# EAGLE design BrushlessLampRoutes (EAGLE 9.7.0)
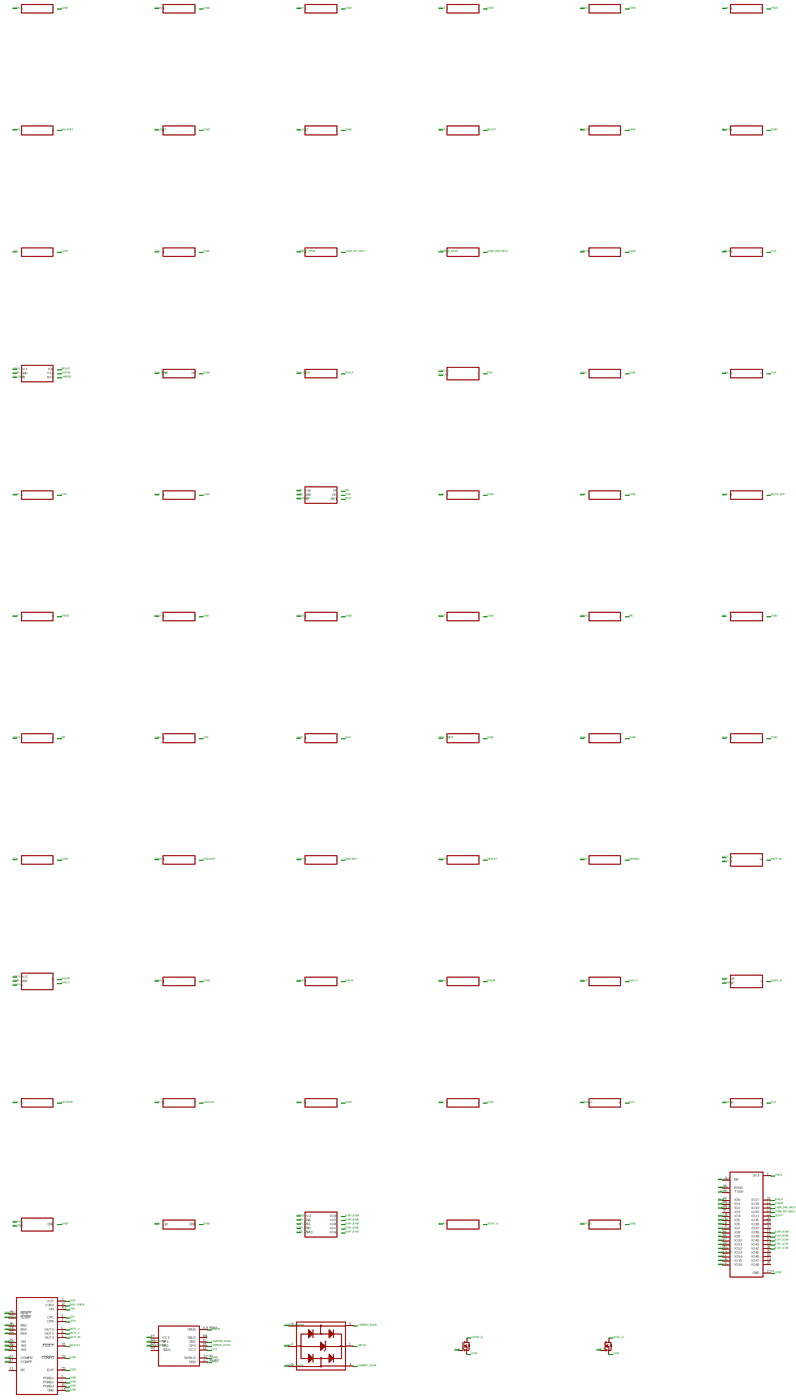
[diagram p0: schematic, sheet 1, overview]
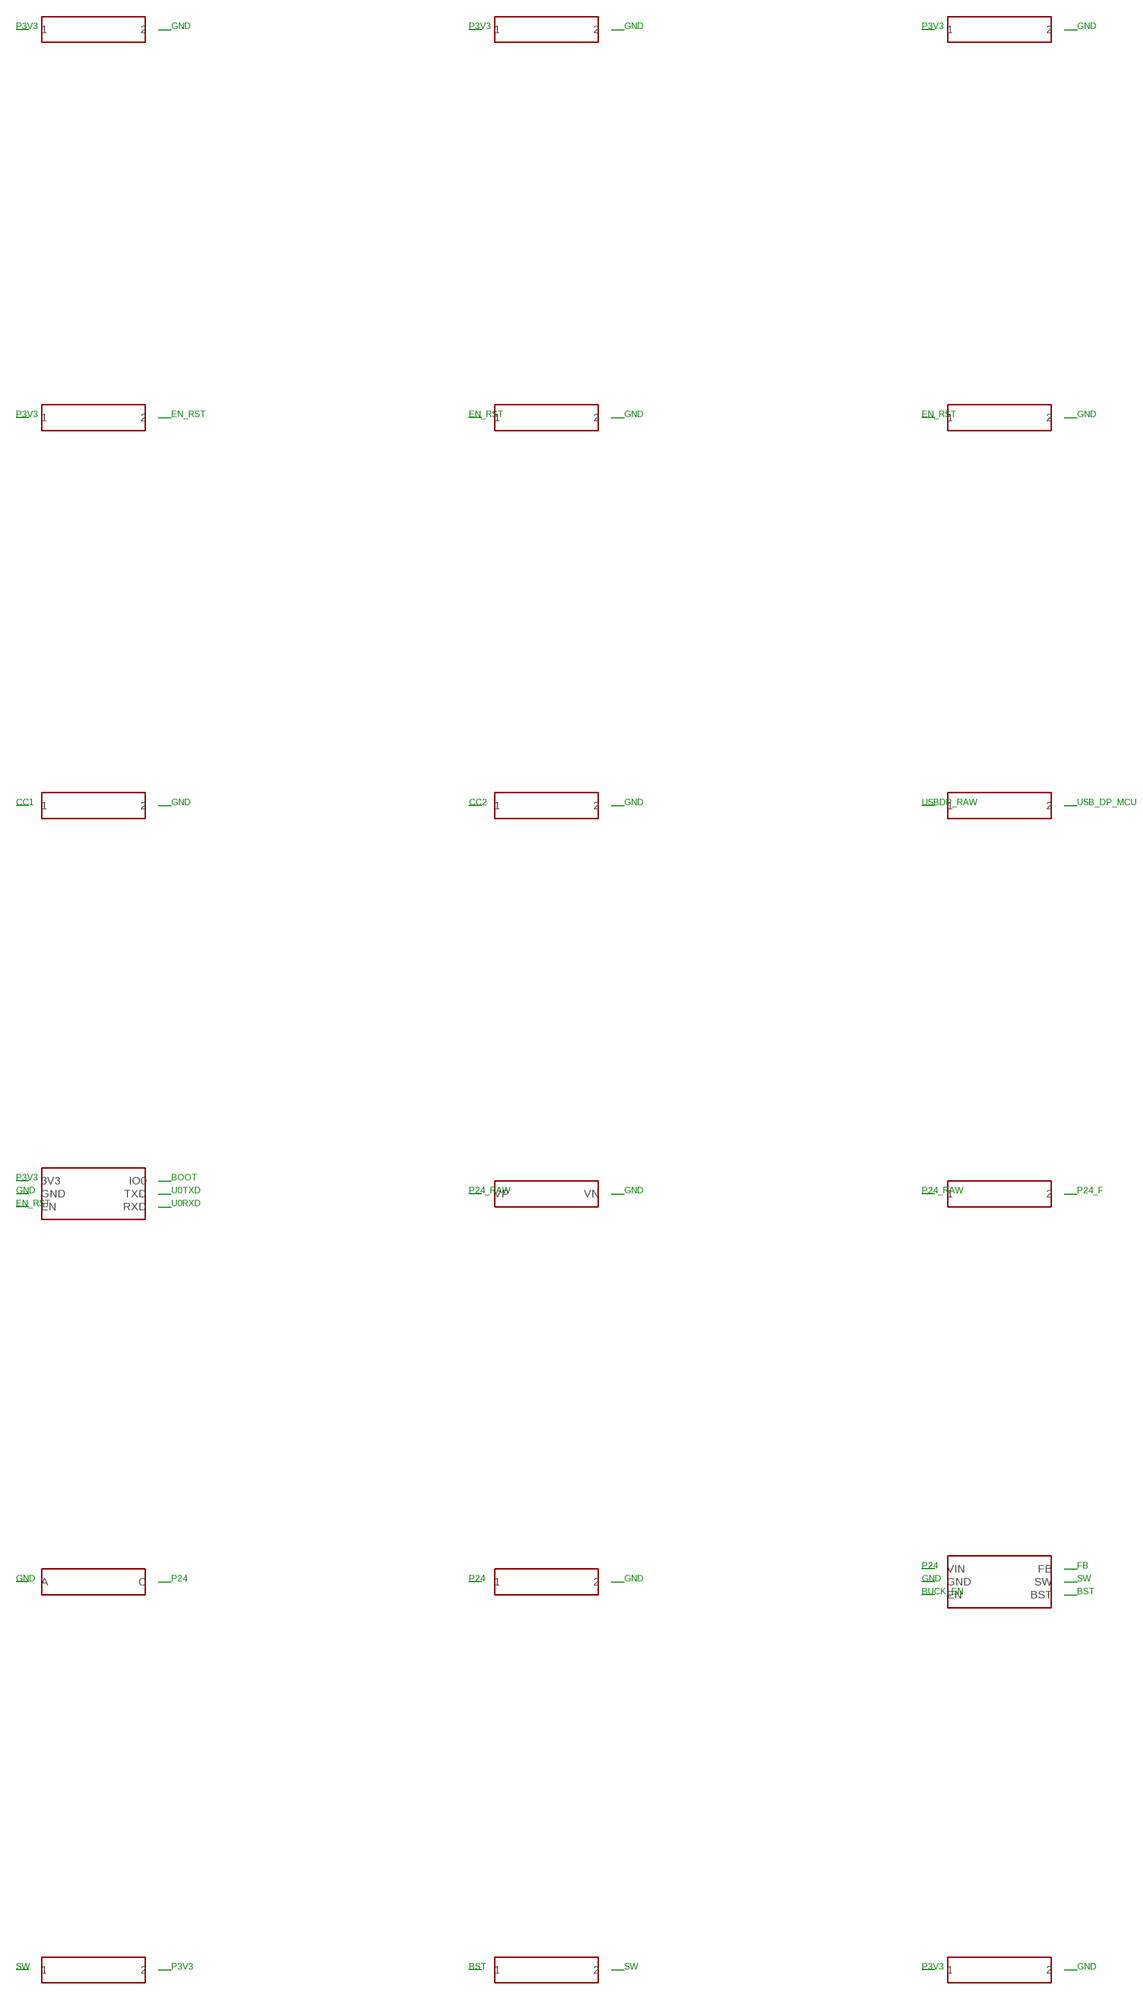
[diagram p1: schematic, sheet 1, part 1 of 4]
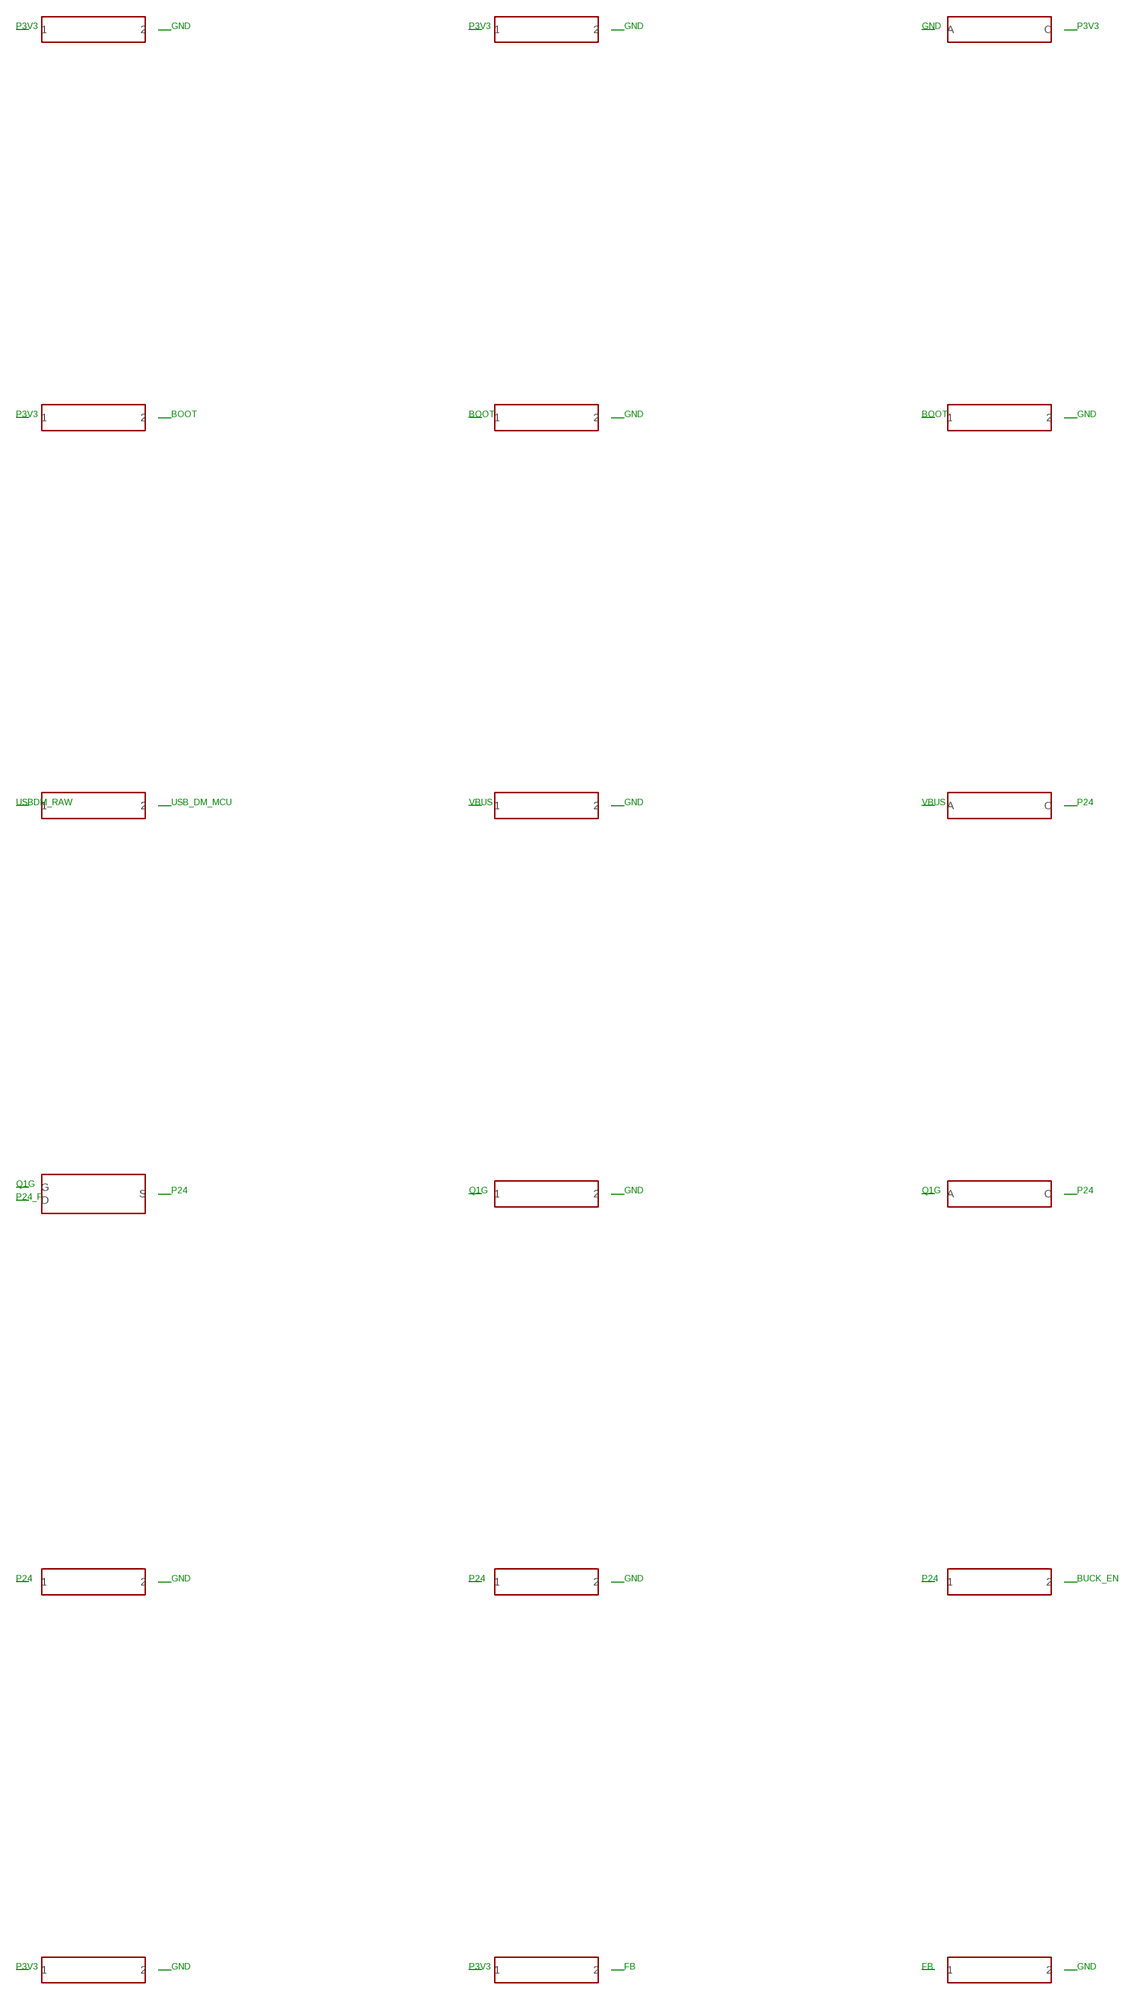
[diagram p2: schematic, sheet 1, part 2 of 4]
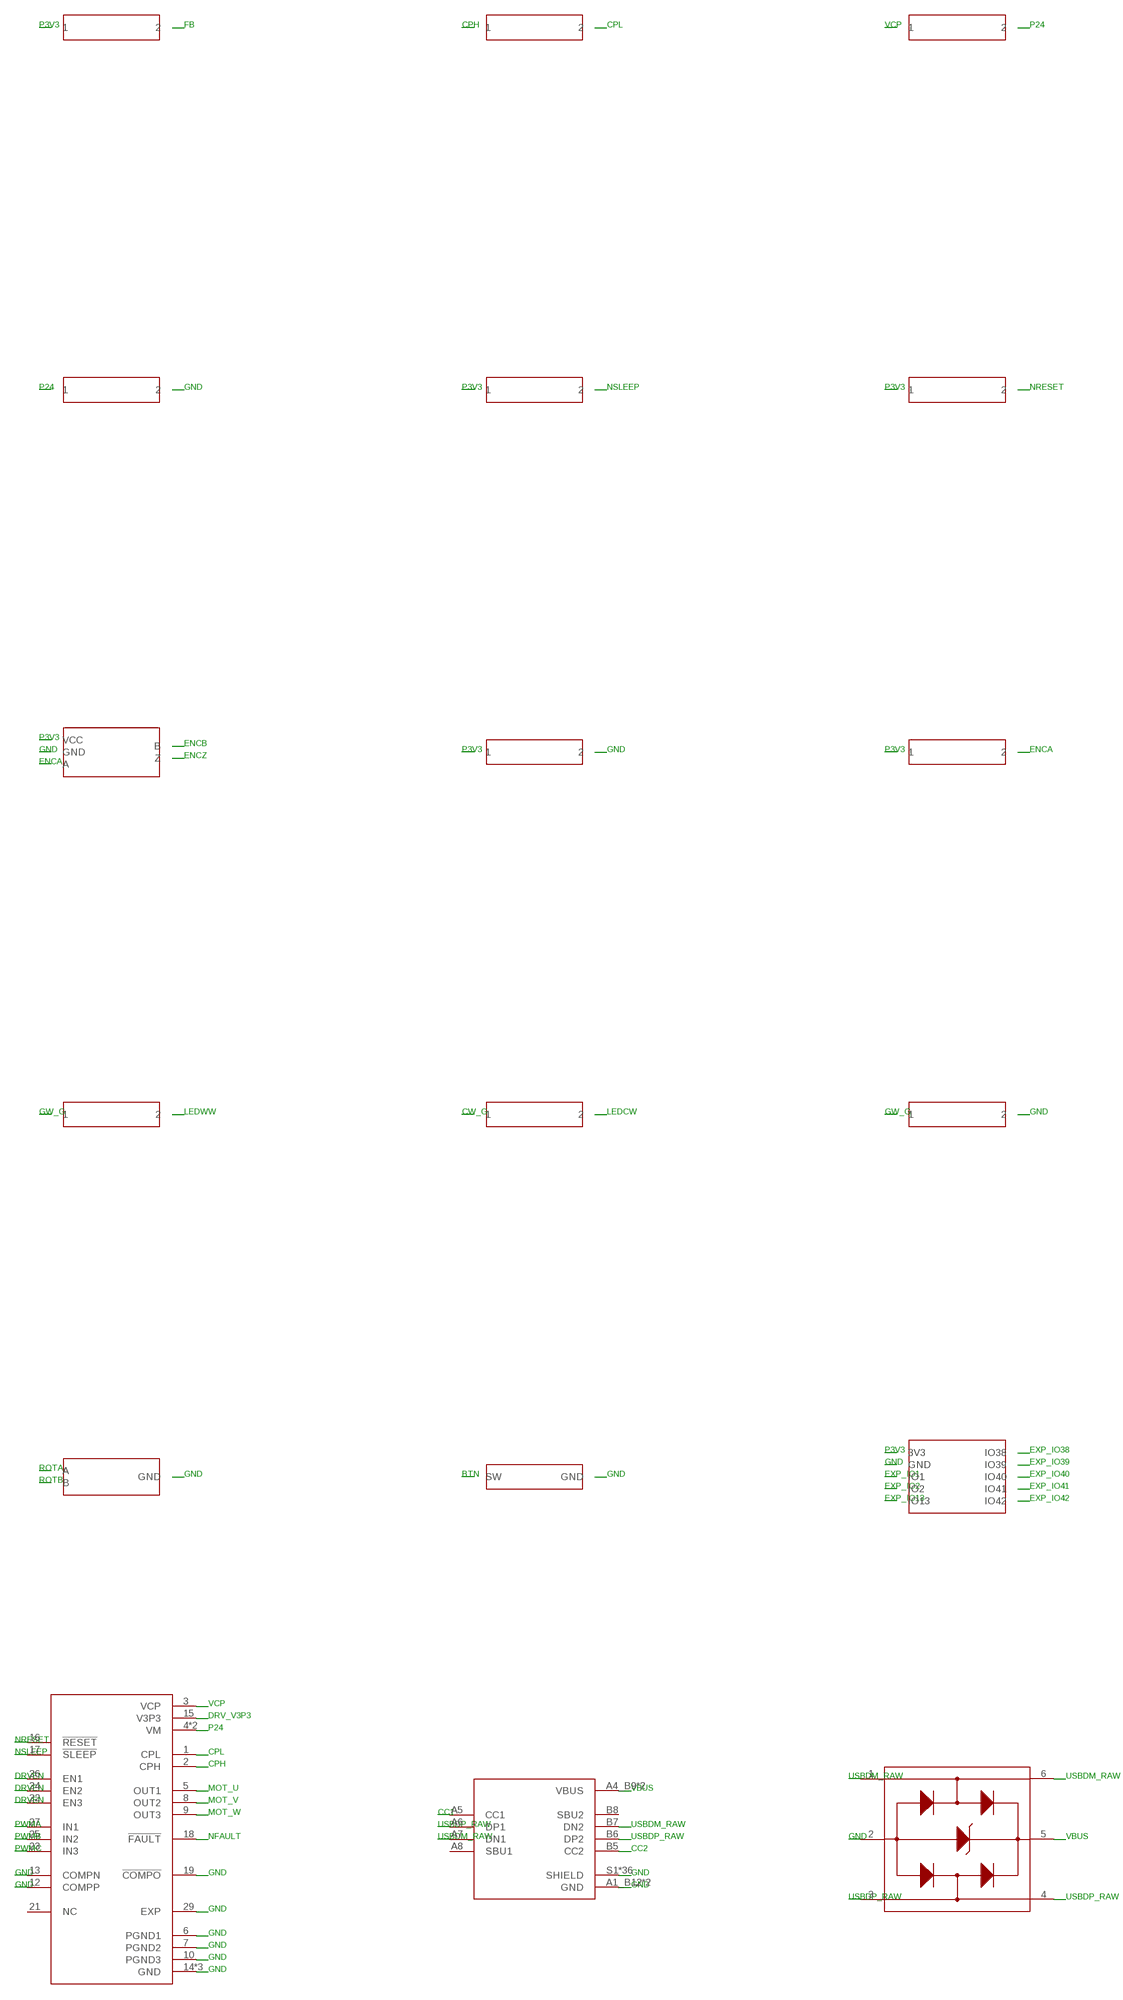
[diagram p3: schematic, sheet 1, part 3 of 4]
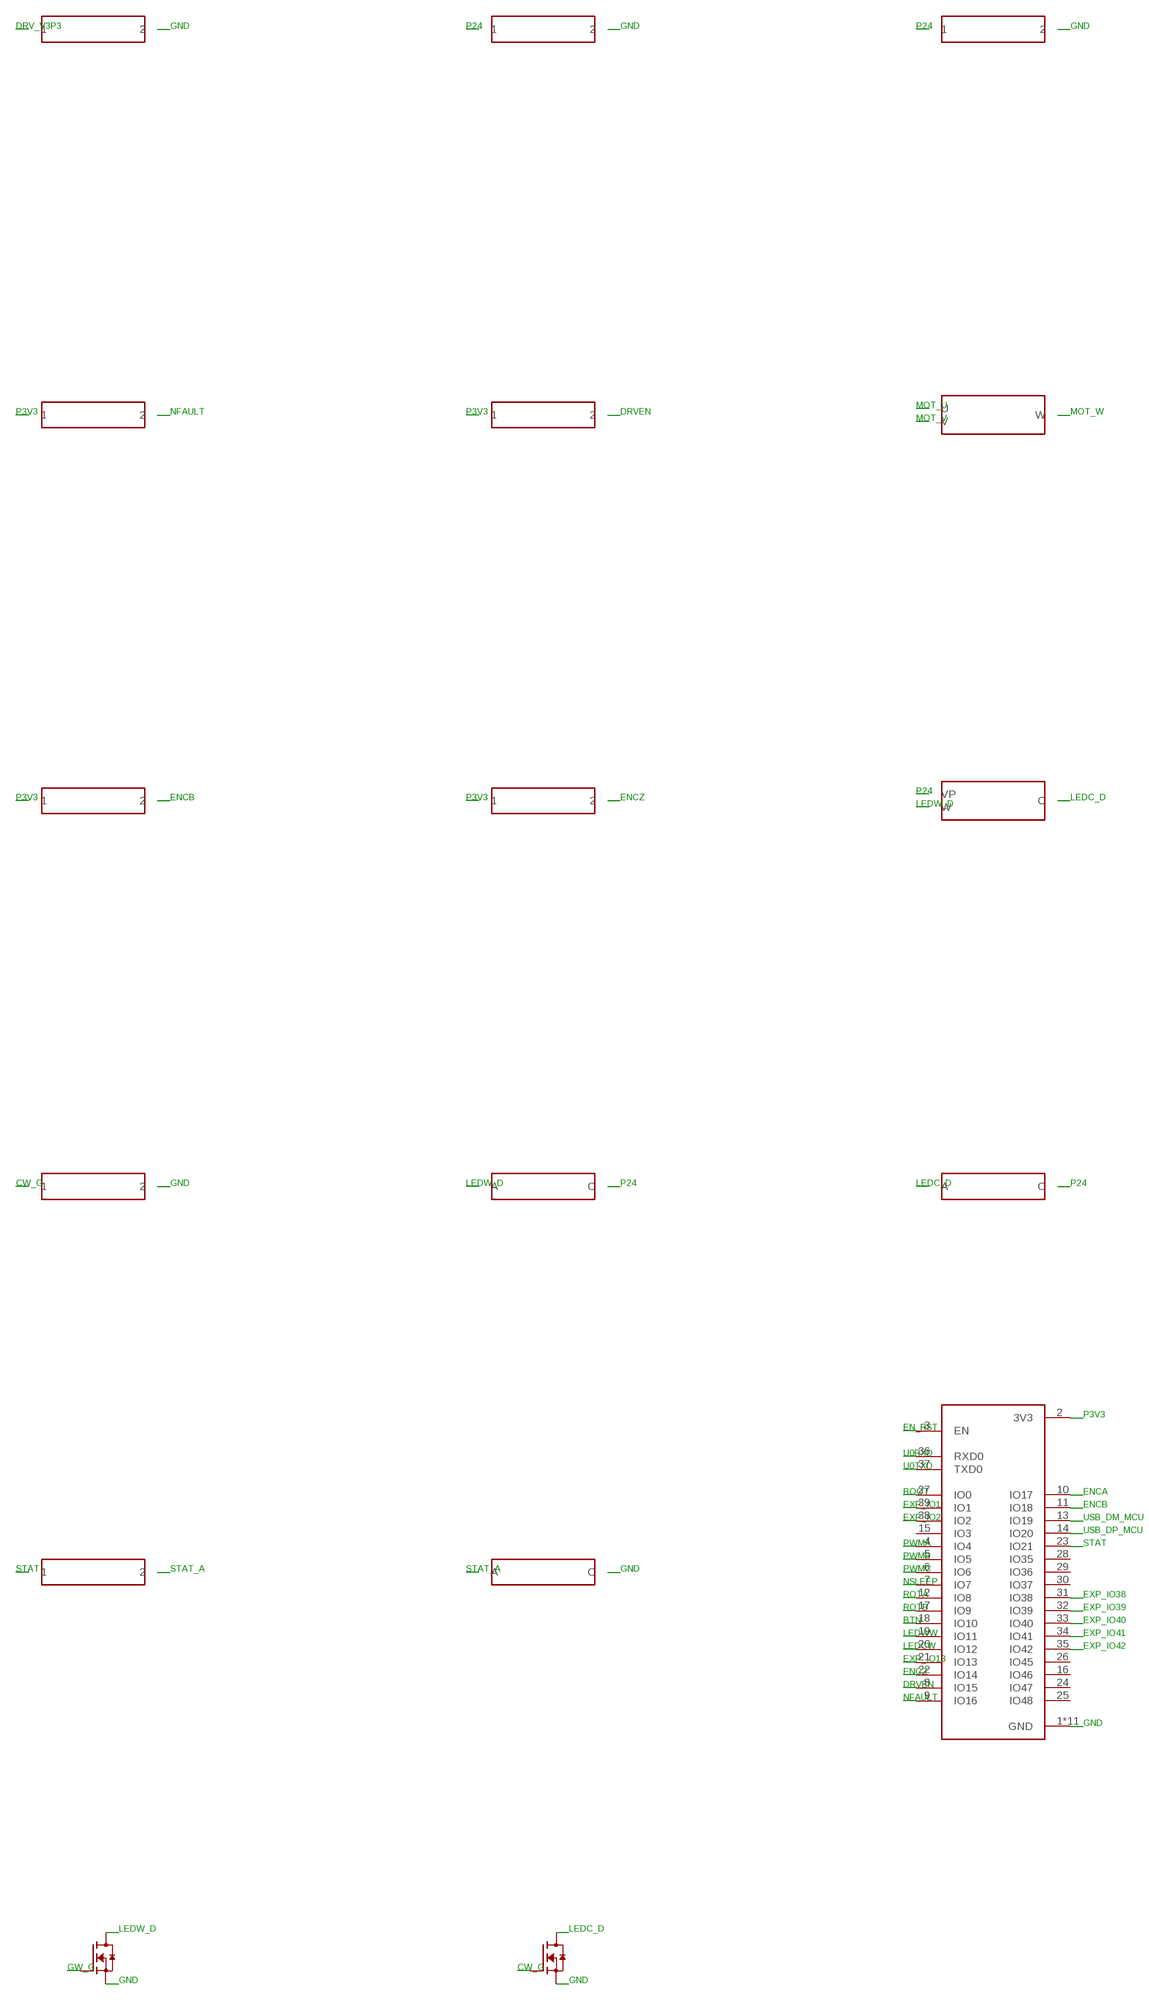
[diagram p4: schematic, sheet 1, part 4 of 4]

## Parts
C_BOOT  100p  CAP_0402  [0402]
C_BOOT_B  100n  CAP_0402  [0402]
C_CP  10n  CAP_0603  [0603]
C_EN  1u  CAP_0603  [0603]
C_FF  22p  CAP_0402  [0402]
C_IN1  10u-50V  CAP_1210  [1210]
C_IN2  4.7u-50V  CAP_1206  [1206]
C_IN_BULK  100u-50V  CAP_V  [CAP_V]
C_MCU1  10u  CAP_0805  [0805]
C_MCU2  1u  CAP_0603  [0603]
C_MCU3  100n  CAP_0402  [0402]
C_MCU4  100n  CAP_0402  [0402]
C_MCU_BULK  470u  CAP_D  [CAP_D]
C_OUT1  22u  CAP_0805  [0805]
C_OUT2  22u  CAP_0805  [0805]
C_SENS  100n  CAP_0402  [0402]
C_V3P3  470n  CAP_0603  [0603]
C_VBUS  4.7u  CAP_0603  [0603]
C_VCP  100n  CAP_0603  [0603]
C_VM1  100n-50V  CAP_0603  [0603]
C_VM2  100n-50V  CAP_0603  [0603]
C_VM_BULK  100u-50V  CAP_V  [CAP_V]
D_CLC  clamp-DNP  DIODE_SOD323  [SOD323]
D_CLW  clamp-DNP  DIODE_SOD323  [SOD323]
D_MCU  ESD  DIODE_SOD323  [SOD323]
D_OR_USB  SS14  DIODE_SMA  [SMA]
D_Q1  10V-Zener  DIODE_SOD123  [SOD123]
D_USB  USBLC6-2SC6  [SOT95P280X145-6N]
F1  2A  FUSE_NANO2  [FUSENANO2]
J_BTN  BUTTON  CONN_BTN_DS  [XH2]
J_EXP  GPIO-EXP  CONN_EXP_DS  [HDR10]
J_KNOB  KNOB  CONN_KNOB_DS  [XH3]
J_LED  CCT-STRIP  CONN_LED_DS  [XH3]
J_MOTOR  MOTOR  CONN_MOTOR_DS  [SCREW3]
J_PROG  UART-FALLBACK  CONN_PROG_DS  [HDR6]
J_PWR  24V-IN  CONN_PWR_DS  [SCREW2]
J_SENSOR  MT6701  CONN_SENSOR_DS  [SCREW5]
J_USB  TYPE-C-31-M-12  [HRO_TYPE-C-31-M-12]
L1  4.7uH  IND_SMD  [IND43]
LED_STATUS  STATUS  LED_0603  [LED0603]
Q1  PMOS-RevProt  FET_SOT23  [SOT23]
Q_CW  AO3400A  [SOT95P280X125-3N]
Q_WW  AO3400A  [SOT95P280X125-3N]
R_AZ_A  10k-DNP  RES_0603  [0603]
R_AZ_B  10k-DNP  RES_0603  [0603]
R_AZ_C  10k-DNP  RES_0603  [0603]
R_BOOT  10k  RES_0603  [0603]
R_CC1  5.1k  RES_0603  [0603]
R_CC2  5.1k  RES_0603  [0603]
R_DM  22R  RES_0603  [0603]
R_DP  22R  RES_0603  [0603]
R_EN  10k  RES_0603  [0603]
R_EN_DRV  10k  RES_0603  [0603]
R_ENB  100k  RES_0603  [0603]
R_FBB  10k  RES_0603  [0603]
R_FBT  45.3k  RES_0603  [0603]
R_GC  33R  RES_0603  [0603]
R_GW  33R  RES_0603  [0603]
R_NFAULT  10k  RES_0603  [0603]
R_NRESET  10k  RES_0603  [0603]
R_NSLEEP  10k  RES_0603  [0603]
R_PDC  100k  RES_0603  [0603]
R_PDW  100k  RES_0603  [0603]
R_Q1  100k  RES_0603  [0603]
R_STATUS  1k  RES_0603  [0603]
SW_BOOT  BOOT  SW_TACT  [TACT]
SW_RST  RESET  SW_TACT  [TACT]
TVS1  SMBJ28A  DIODE_SMB  [SMB]
U_BUCK  LMR51430  BUCK_DS  [SOT236]
U_DRV  DRV8313PWPR  [SOP65P640X120-29N]
U_MCU  ESP32-S3-WROOM-1-N8R8  [XCVR_ESP32S3WROOM1N8R8]

## Nets
BOOT: C_BOOT.1 J_PROG.4(IO0) R_BOOT.2 SW_BOOT.1 SW_BOOT.2 U_MCU.27(IO0)
BST: C_BOOT_B.1 U_BUCK.6(BST)
BTN: J_BTN.1(SW) U_MCU.18(IO10)
BUCK_EN: R_ENB.2 U_BUCK.5(EN)
CC1: J_USB.A5(CC1) R_CC1.1
CC2: J_USB.B5(CC2) R_CC2.1
CPH: C_CP.1 U_DRV.2(CPH)
CPL: C_CP.2 U_DRV.1(CPL)
CW_G: Q_CW.1(G) R_GC.1 R_PDC.1
DRV_V3P3: C_V3P3.1 U_DRV.15(V3P3)
DRVEN: R_EN_DRV.2 U_DRV.22(EN3) U_DRV.24(EN2) U_DRV.26(EN1) U_MCU.8(IO15)
EN_RST: C_EN.1 J_PROG.3(EN) R_EN.2 SW_RST.1 SW_RST.2 U_MCU.3(EN)
ENCA: J_SENSOR.3(A) R_AZ_A.2 U_MCU.10(IO17)
ENCB: J_SENSOR.4(B) R_AZ_B.2 U_MCU.11(IO18)
ENCZ: J_SENSOR.5(Z) R_AZ_C.2 U_MCU.22(IO14)
EXP_IO1: J_EXP.3(IO1) U_MCU.39(IO1)
EXP_IO2: J_EXP.4(IO2) U_MCU.38(IO2)
EXP_IO13: J_EXP.5(IO13) U_MCU.21(IO13)
EXP_IO38: J_EXP.6(IO38) U_MCU.31(IO38)
EXP_IO39: J_EXP.7(IO39) U_MCU.32(IO39)
EXP_IO40: J_EXP.8(IO40) U_MCU.33(IO40)
EXP_IO41: J_EXP.9(IO41) U_MCU.34(IO41)
EXP_IO42: J_EXP.10(IO42) U_MCU.35(IO42)
FB: C_FF.2 R_FBB.1 R_FBT.2 U_BUCK.4(FB)
GND: C_BOOT.2 C_EN.2 C_IN1.2 C_IN2.2 C_IN_BULK.2 C_MCU1.2 C_MCU2.2 C_MCU3.2 C_MCU4.2 C_MCU_BULK.2 C_OUT1.2 C_OUT2.2 C_SENS.2 C_V3P3.2 C_VBUS.2 C_VM1.2 C_VM2.2 C_VM_BULK.2 D_MCU.A D_USB.2(GND) J_BTN.2(GND) J_EXP.2(GND) J_KNOB.3(GND) J_PROG.2(GND) J_PWR.2(VN) J_SENSOR.2(GND) J_USB.A1_B12(GND) J_USB.B1_A12(GND) J_USB.S1(SHIELD) J_USB.S1B(SHIELD) J_USB.S1C(SHIELD) J_USB.S1D(SHIELD) J_USB.S1E(SHIELD) J_USB.S1F(SHIELD) J_USB.S1G(SHIELD) J_USB.S1H(SHIELD) J_USB.S1I(SHIELD) J_USB.S2(SHIELD) J_USB.S2B(SHIELD) J_USB.S2C(SHIELD) J_USB.S2D(SHIELD) J_USB.S2E(SHIELD) J_USB.S2F(SHIELD) J_USB.S2G(SHIELD) J_USB.S2H(SHIELD) J_USB.S2I(SHIELD) J_USB.S3(SHIELD) J_USB.S3B(SHIELD) J_USB.S3C(SHIELD) J_USB.S3D(SHIELD) J_USB.S3E(SHIELD) J_USB.S3F(SHIELD) J_USB.S3G(SHIELD) J_USB.S3H(SHIELD) J_USB.S3I(SHIELD) J_USB.S4(SHIELD) J_USB.S4B(SHIELD) J_USB.S4C(SHIELD) J_USB.S4D(SHIELD) J_USB.S4E(SHIELD) J_USB.S4F(SHIELD) J_USB.S4G(SHIELD) J_USB.S4H(SHIELD) J_USB.S4I(SHIELD) LED_STATUS.C Q_CW.2(S) Q_WW.2(S) R_CC1.2 R_CC2.2 R_FBB.2 R_PDC.2 R_PDW.2 R_Q1.2 SW_BOOT.3 SW_BOOT.4 SW_RST.3 SW_RST.4 TVS1.A U_BUCK.1(GND) U_DRV.6(PGND1) U_DRV.7(PGND2) U_DRV.10(PGND3) U_DRV.12(COMPP) U_DRV.13(COMPN) U_DRV.14(GND) U_DRV.19(!COMPO) U_DRV.20(GND) U_DRV.28(GND) U_DRV.29(EXP) U_MCU.1(GND) U_MCU.40(GND) U_MCU.41_1(GND) U_MCU.41_2(GND) U_MCU.41_3(GND) U_MCU.41_4(GND) U_MCU.41_5(GND) U_MCU.41_6(GND) U_MCU.41_7(GND) U_MCU.41_8(GND) U_MCU.41_9(GND)
GW_G: Q_WW.1(G) R_GW.1 R_PDW.1
LEDC_D: D_CLC.A J_LED.3(C) Q_CW.3(D)
LEDCW: R_GC.2 U_MCU.20(IO12)
LEDW_D: D_CLW.A J_LED.2(W) Q_WW.3(D)
LEDWW: R_GW.2 U_MCU.19(IO11)
MOT_U: J_MOTOR.1(U) U_DRV.5(OUT1)
MOT_V: J_MOTOR.2(V) U_DRV.8(OUT2)
MOT_W: J_MOTOR.3(W) U_DRV.9(OUT3)
NFAULT: R_NFAULT.2 U_DRV.18(!FAULT) U_MCU.9(IO16)
NRESET: R_NRESET.2 U_DRV.16(!RESET)
NSLEEP: R_NSLEEP.2 U_DRV.17(!SLEEP) U_MCU.7(IO7)
P3V3 [pwr3v3]: C_FF.1 C_MCU1.1 C_MCU2.1 C_MCU3.1 C_MCU4.1 C_MCU_BULK.1 C_OUT1.1 C_OUT2.1 C_SENS.1 D_MCU.C J_EXP.1(3V3) J_PROG.1(3V3) J_SENSOR.1(VCC) L1.2 R_AZ_A.1 R_AZ_B.1 R_AZ_C.1 R_BOOT.1 R_EN.1 R_EN_DRV.1 R_FBT.1 R_NFAULT.1 R_NRESET.1 R_NSLEEP.1 U_MCU.2(3V3)
P24 [pwr24]: C_IN1.1 C_IN2.1 C_IN_BULK.1 C_VCP.2 C_VM1.1 C_VM2.1 C_VM_BULK.1 D_CLC.C D_CLW.C D_OR_USB.C D_Q1.C J_LED.1(VP) Q1.2(S) R_ENB.1 TVS1.C U_BUCK.3(VIN) U_DRV.4(VM) U_DRV.11(VM)
P24_F [pwr24]: F1.2 Q1.3(D)
P24_RAW [pwr24]: F1.1 J_PWR.1(VP)
PWMA: U_DRV.27(IN1) U_MCU.4(IO4)
PWMB: U_DRV.25(IN2) U_MCU.5(IO5)
PWMC: U_DRV.23(IN3) U_MCU.6(IO6)
Q1G: D_Q1.A Q1.1(G) R_Q1.1
ROTA: J_KNOB.1(A) U_MCU.12(IO8)
ROTB: J_KNOB.2(B) U_MCU.17(IO9)
STAT: R_STATUS.1 U_MCU.23(IO21)
STAT_A: LED_STATUS.A R_STATUS.2
SW: C_BOOT_B.2 L1.1 U_BUCK.2(SW)
U0RXD: J_PROG.6(RXD) U_MCU.36(RXD0)
U0TXD: J_PROG.5(TXD) U_MCU.37(TXD0)
USB_DM_MCU: R_DM.2 U_MCU.13(IO19)
USB_DP_MCU: R_DP.2 U_MCU.14(IO20)
USBDM_RAW: D_USB.1(I/O1_IN) D_USB.6(I/O1_OUT) J_USB.A7(DN1) J_USB.B7(DN2) R_DM.1
USBDP_RAW: D_USB.3(I/O2_IN) D_USB.4(I/O2_OUT) J_USB.A6(DP1) J_USB.B6(DP2) R_DP.1
VBUS [pwr3v3]: C_VBUS.1 D_OR_USB.A D_USB.5(VBUS) J_USB.A4_B9(VBUS) J_USB.B4_A9(VBUS)
VCP: C_VCP.1 U_DRV.3(VCP)
Unconnected: J_USB.A8(SBU1) J_USB.B8(SBU2) U_DRV.21(NC) U_MCU.15(IO3) U_MCU.16(IO46) U_MCU.24(IO47) U_MCU.25(IO48) U_MCU.26(IO45) U_MCU.28(IO35) U_MCU.29(IO36) U_MCU.30(IO37)

## Library data of the parts
C_BOOT C_BOOT_B C_FF C_MCU3 C_MCU4 C_SENS = BLLIB:CAP_0402
C_CP C_EN C_MCU2 C_V3P3 C_VBUS C_VCP C_VM1 C_VM2 = BLLIB:CAP_0603
C_IN1 = BLLIB:CAP_1210
C_IN2 = BLLIB:CAP_1206
C_IN_BULK C_VM_BULK = BLLIB:CAP_V
C_MCU1 C_OUT1 C_OUT2 = BLLIB:CAP_0805
C_MCU_BULK = BLLIB:CAP_D
D_CLC D_CLW D_MCU = BLLIB:DIODE_SOD323
D_OR_USB = BLLIB:DIODE_SMA
D_Q1 = BLLIB:DIODE_SOD123
D_USB = USBLC6-2SC6:USBLC6-2SC6: Check availability <https://pricing.snapeda.com/parts/USBLC6-2SC6/STMicroelectronics/view-part?ref=eda>; AVAILABILITY: In Stock; CHECK_PRICES: https://www.snapeda.com/parts/USBLC6-2SC6/STMicroelectronics/view-part/?ref=eda; DESCRIPTION: 17V Clamp 5A (8/20µs) Ipp Tvs Diode Surface Mount SOT-23-6; MF: STMicroelectronics; MP: USBLC6-2SC6; PACKAGE: SOT-23-6 STMicroelectronics; PRICE: None; PURCHASE-URL: https://www.snapeda.com/api/url_track_click_mouser/?unipart_id=231887&manufacturer=STMicroelectronics&part_name=USBLC6-2SC6&search_term= usblc6-2sc6; SNAPEDA_LINK: https://www.snapeda.com/parts/USBLC6-2SC6/STMicroelectronics/view-part/?ref=snap
F1 = BLLIB:FUSE_NANO2
J_BTN = JST-XH-BL:CONN_BTN_DS
J_EXP = BLLIB:CONN_EXP_DS
J_KNOB = JST-XH-BL:CONN_KNOB_DS
J_LED = JST-XH-BL:CONN_LED_DS
J_MOTOR = BLLIB:CONN_MOTOR_DS
J_PROG = BLLIB:CONN_PROG_DS
J_PWR = BLLIB:CONN_PWR_DS
J_SENSOR = KF350-SENSOR:CONN_SENSOR_DS
J_USB = TYPE-C-31-M-12:TYPE-C-31-M-12: Check availability <https://pricing.snapeda.com/parts/TYPE-C-31-M-12/HRO%20Electronics%20Co.%2C%20Ltd./view-part?ref=eda>; AVAILABILITY: Not in stock; CHECK_PRICES: https://www.snapeda.com/parts/TYPE-C-31-M-12/HRO+Electronics+Co.%252C+Ltd./view-part/?ref=eda; DESCRIPTION: USB Connectors 24 Receptacle 1 8.94*7.3mm RoHS; MF: HRO Electronics Co., Ltd.; MP: TYPE-C-31-M-12; PACKAGE: Package; PRICE: None; SNAPEDA_LINK: https://www.snapeda.com/parts/TYPE-C-31-M-12/HRO+Electronics+Co.%252C+Ltd./view-part/?ref=snap
L1 = BLLIB:IND_SMD
LED_STATUS = BLLIB:LED_0603
Q1 = BLLIB:FET_SOT23
Q_CW Q_WW = AO3400A:AO3400A: Check availability <https://pricing.snapeda.com/parts/AO3400A/UMW/view-part?ref=eda>; AVAILABILITY: In Stock; CHECK_PRICES: https://www.snapeda.com/parts/AO3400A/UMW/view-part/?ref=eda; DESCRIPTION: N-Channel 30 V 5.8A (Ta) 1.4W (Ta) Surface Mount SOT-23; MF: UMW; MP: AO3400A; PACKAGE: None; PRICE: None; SNAPEDA_LINK: https://www.snapeda.com/parts/AO3400A/UMW/view-part/?ref=snap
R_AZ_A R_AZ_B R_AZ_C R_BOOT R_CC1 R_CC2 R_DM R_DP R_EN R_EN_DRV R_ENB R_FBB R_FBT R_GC R_GW R_NFAULT R_NRESET R_NSLEEP R_PDC R_PDW R_Q1 R_STATUS = BLLIB:RES_0603
SW_BOOT SW_RST = TS-1187A:SW_TACT
TVS1 = BLLIB:DIODE_SMB
U_BUCK = BLLIB:BUCK_DS
U_DRV = DRV8313PWPR:DRV8313PWPR: Check availability <https://pricing.snapeda.com/parts/DRV8313PWPR/Texas%20Instruments/view-part?ref=eda>; AVAILABILITY: In Stock; CHECK_PRICES: https://www.snapeda.com/parts/DRV8313PWPR/Texas+Instruments/view-part/?ref=eda; DESCRIPTION: 65-V max 3-A peak 3-phase motor driver with integrated FETs; MF: Texas Instruments; MP: DRV8313PWPR; PACKAGE: HTSSOP-28 Texas Instruments; PRICE: None; SNAPEDA_LINK: https://www.snapeda.com/parts/DRV8313PWPR/Texas+Instruments/view-part/?ref=snap
U_MCU = ESP32-S3-WROOM-1-N8R8:ESP32-S3-WROOM-1-N8R8: Check availability <https://pricing.snapeda.com/parts/ESP32-S3-WROOM-1-N8R8/Espressif%20Systems/view-part?ref=eda>; AVAILABILITY: In Stock; CHECK_PRICES: https://www.snapeda.com/parts/ESP32-S3-WROOM-1-N8R8/Espressif+Systems/view-part/?ref=eda; DESCRIPTION: Bluetooth, WiFi 802.11b/g/n, Bluetooth v5.0 Transceiver Module 2.4GHz PCB Trace Surface Mount; MF: Espressif Systems; MP: ESP32-S3-WROOM-1-N8R8; PACKAGE: NON STANDARD Espressif Systems; PRICE: None; PURCHASE-URL: https://www.snapeda.com/api/url_track_click_mouser/?unipart_id=8936581&manufacturer=Espressif Systems&part_name=ESP32-S3-WROOM-1-N8R8&search_term= esp32-s3-wroom-1-n8r8; SNAPEDA_LINK: https://www.snapeda.com/parts/ESP32-S3-WROOM-1-N8R8/Espressif+Systems/view-part/?ref=snap

## Net classes
1 pwr24: width 0.4 mm
2 pwr3v3: width 0.25 mm

## Board
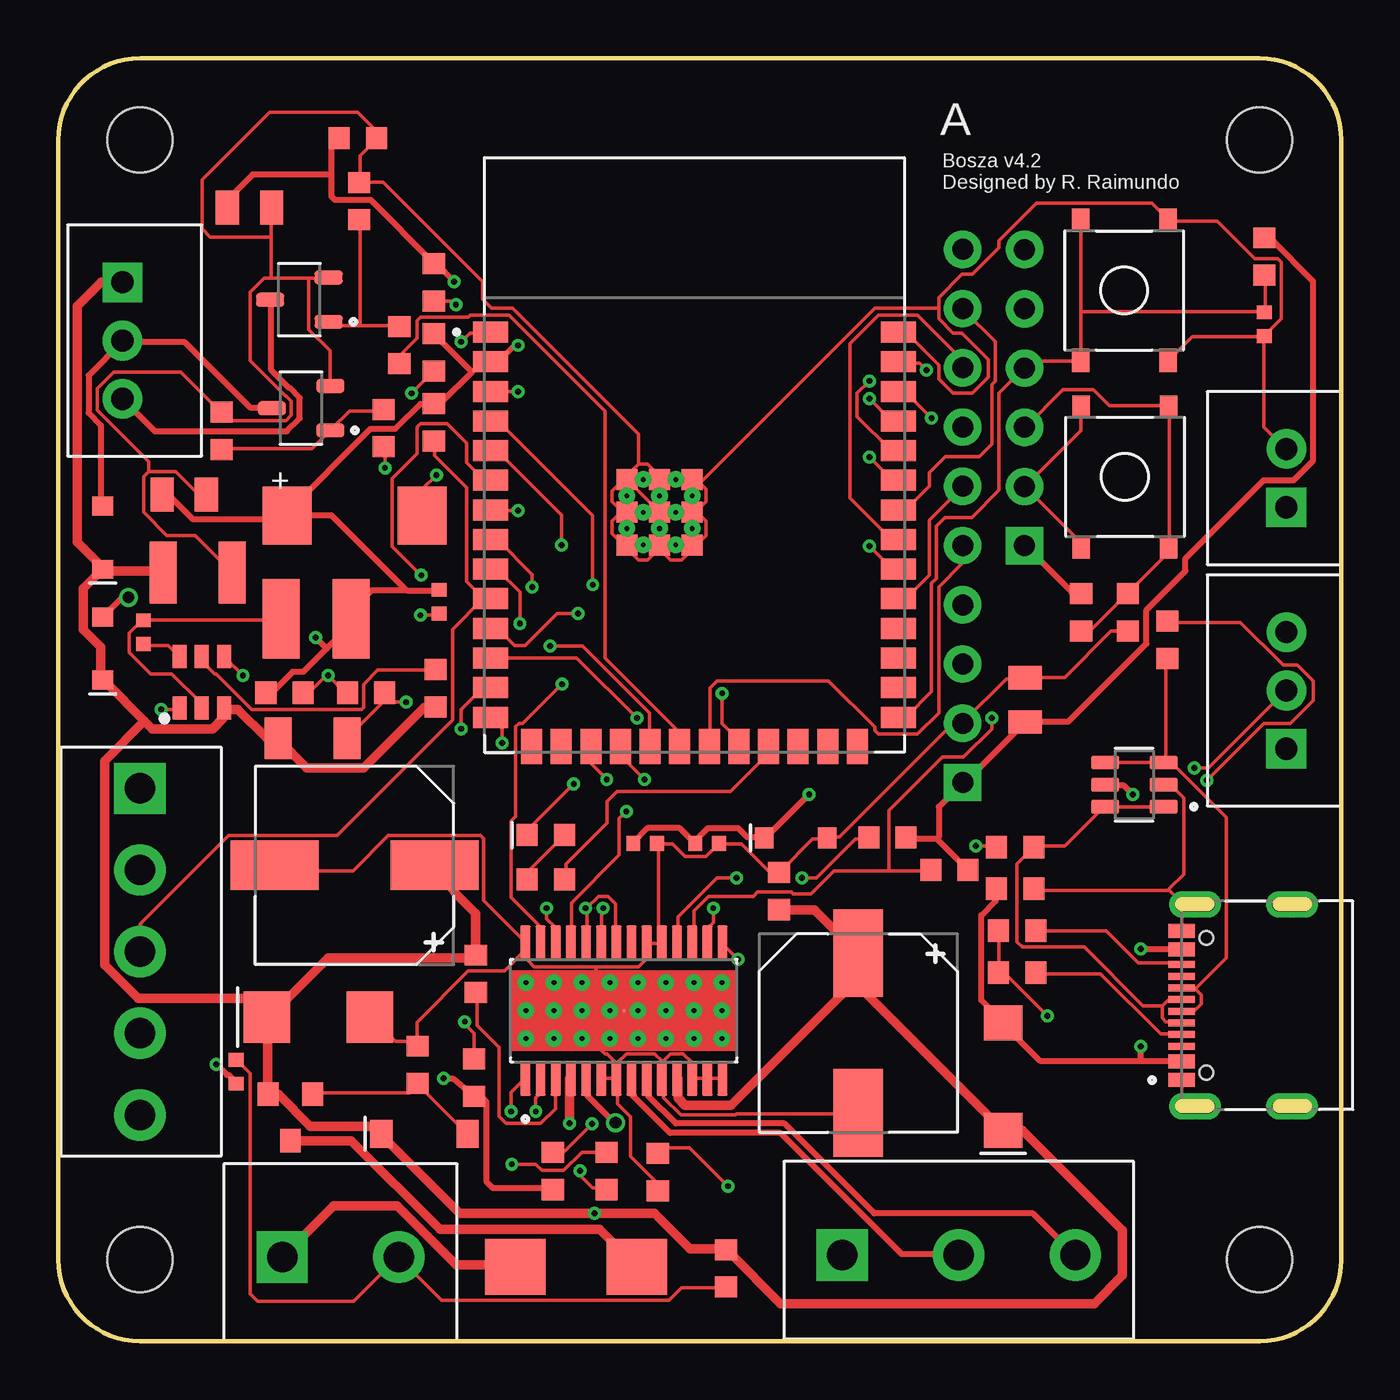
[diagram p5: board, top side]
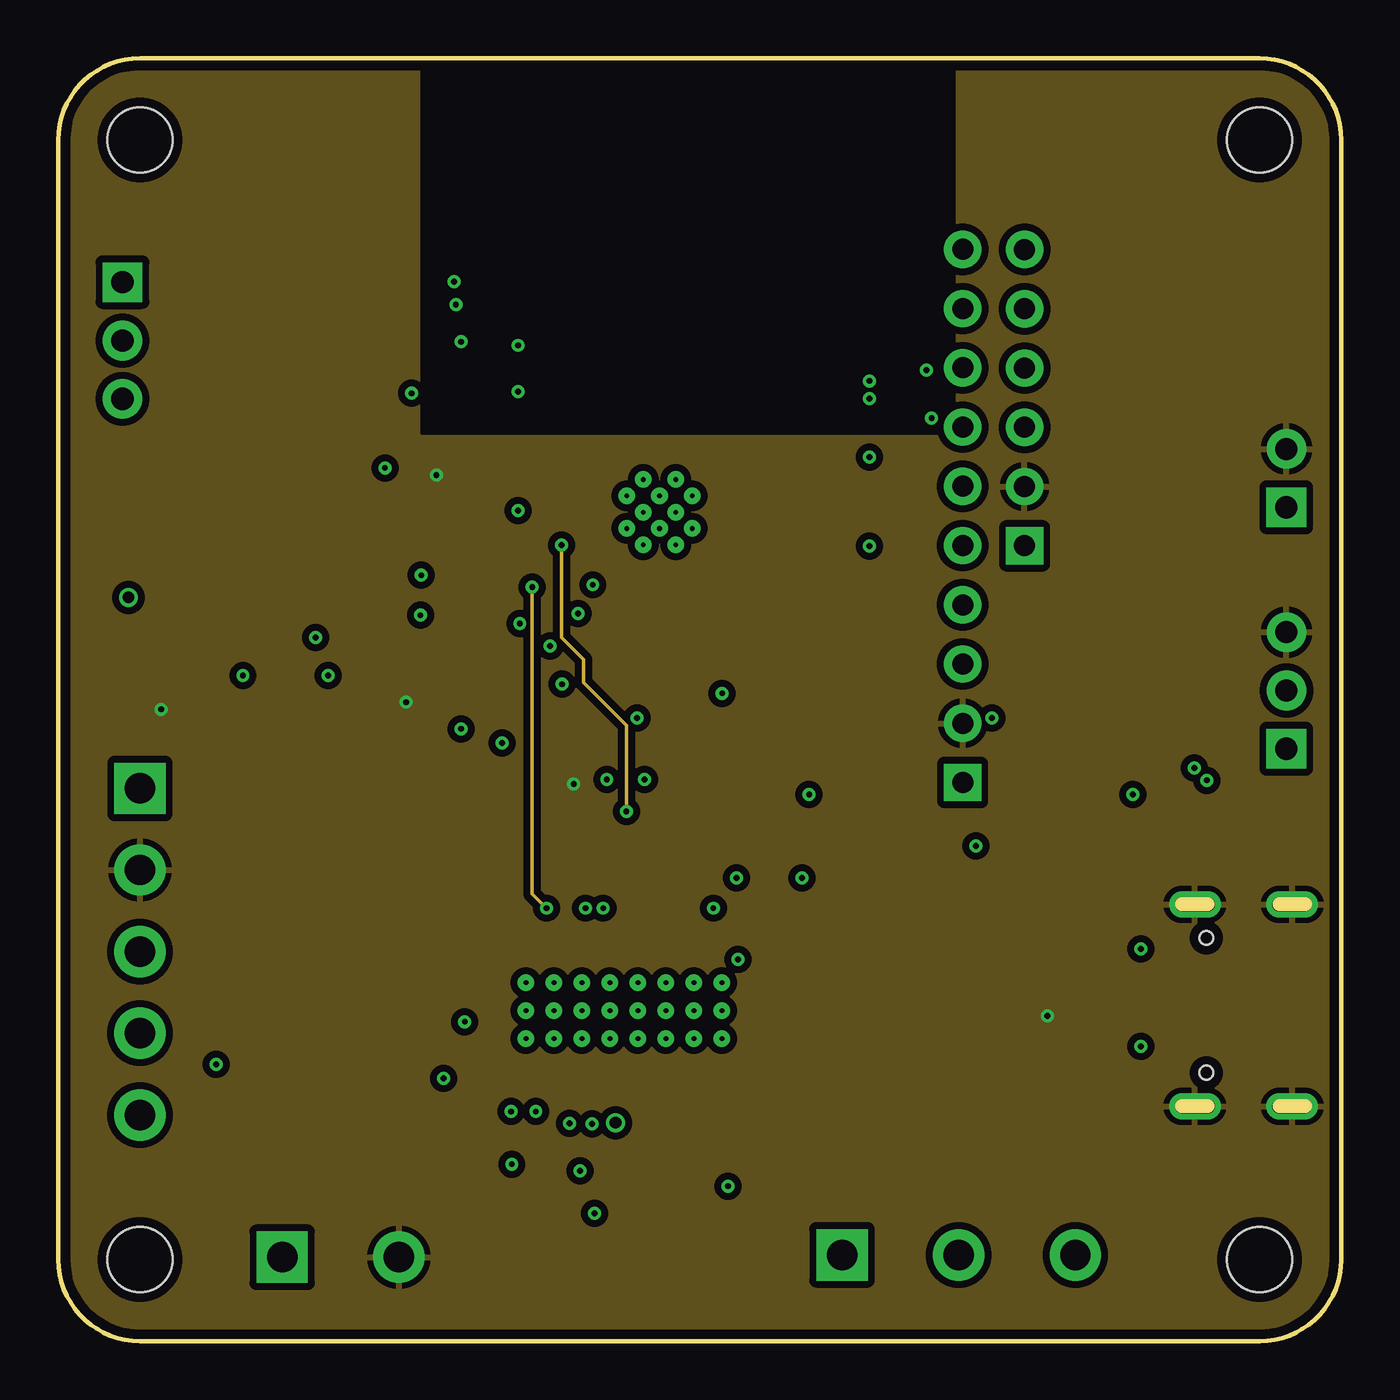
[diagram p6: board, inner layer Route2]
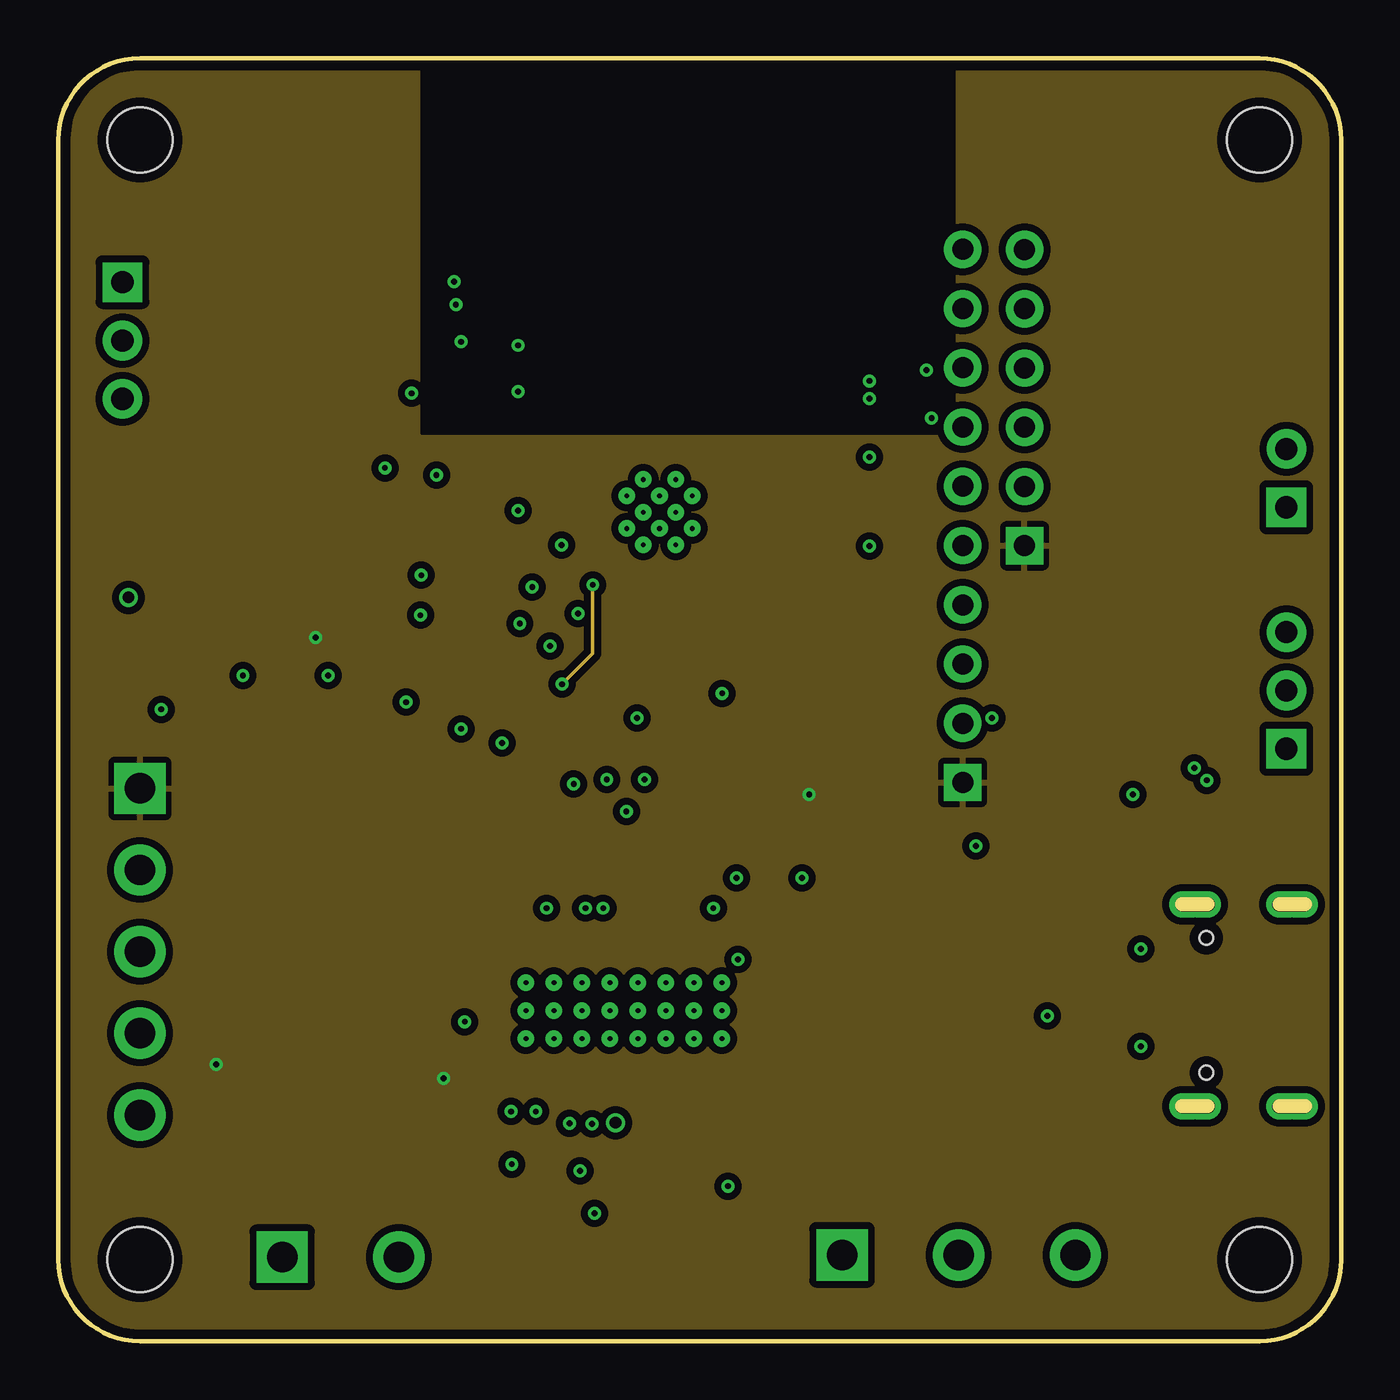
[diagram p7: board, inner layer Route15]
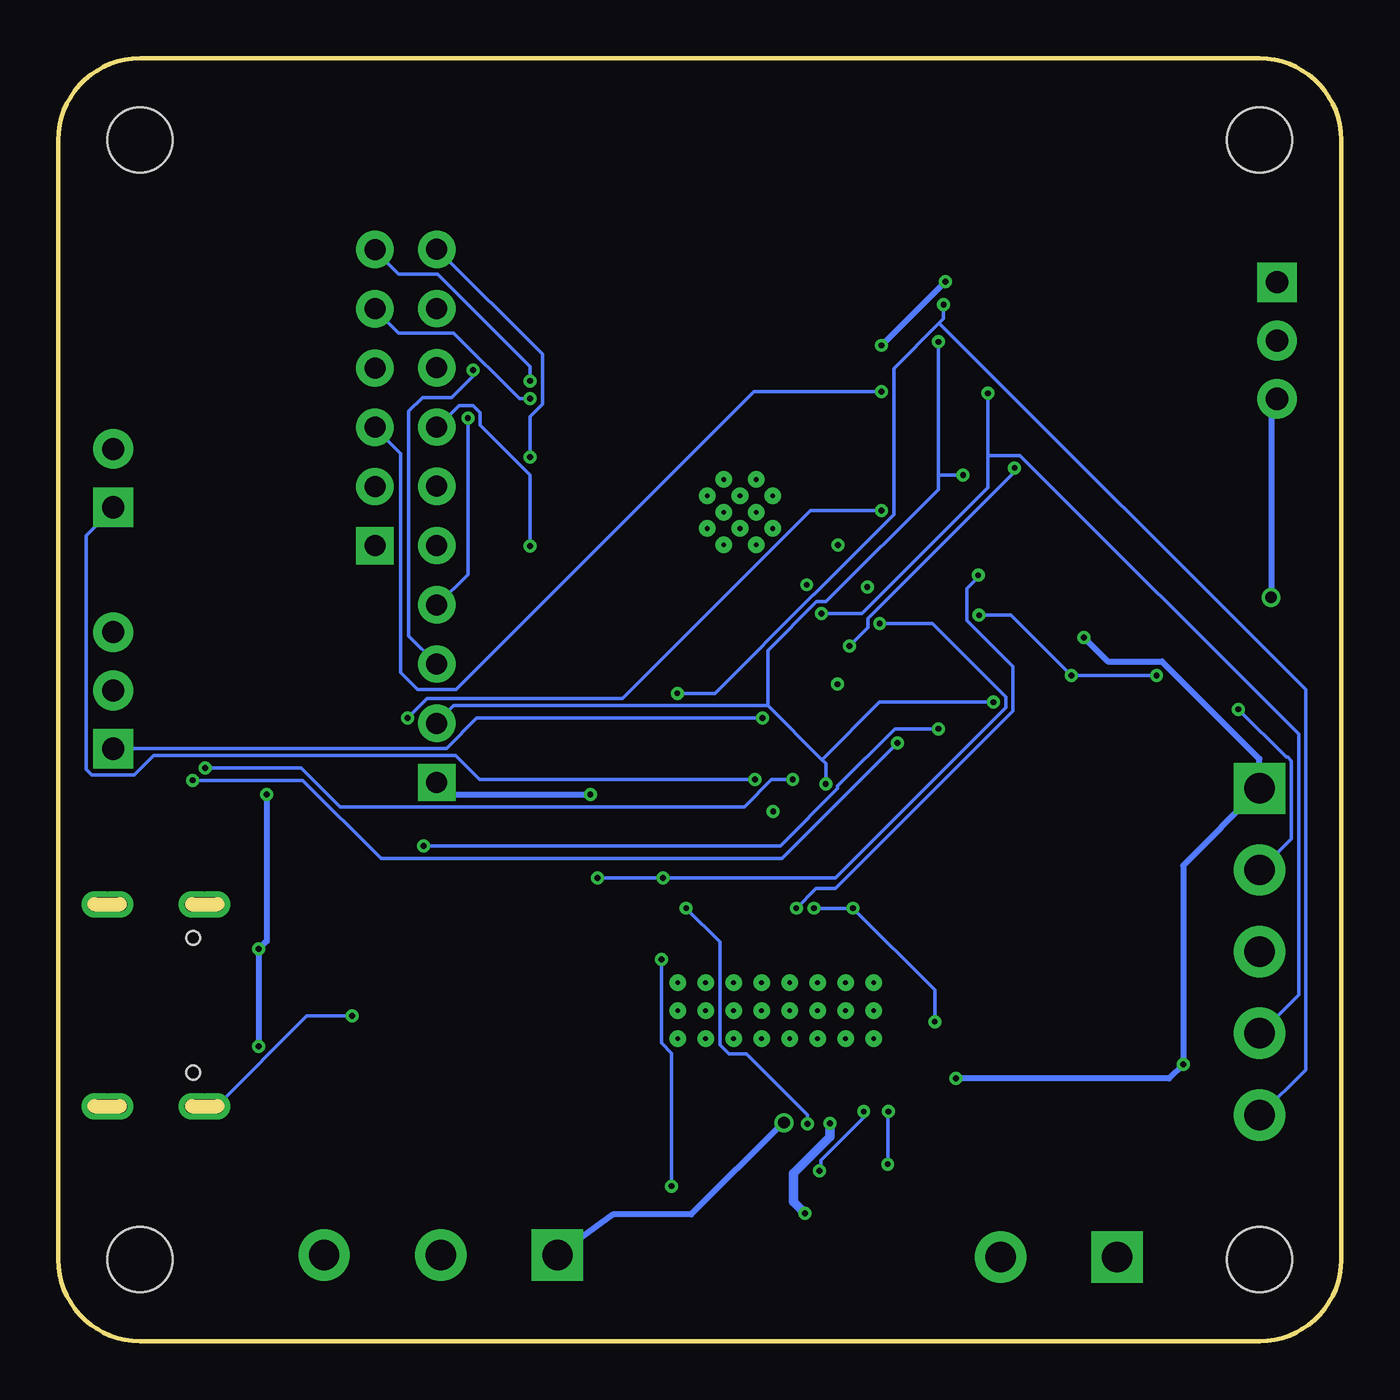
[diagram p8: board, bottom side, seen from below]

Size 55 x 55 mm. Coordinates in mm from the lower left corner, seen from the top.
Outline: 3.5,0 51.5,0 arc90 55,3.5 55,51.5 arc90 51.5,55 3.5,55 arc90 0,51.5 0,3.5 arc90 3.5,0
Copper layers (1+2*15+16): Top 0.035mm / dielectric 1.5mm / Route2 0.035mm / dielectric 0.15mm / Route15 0.035mm / dielectric 0.2mm / Bottom 0.035mm
Design rules "PCBWay.dru *": minimum track width 6mil, minimum drill 0.25mm, track to track 0.152mm, track to pad 0.152mm, pad to pad 0.152mm, via to via 0.152mm, smd to smd 6mil, copper to edge 16mil, drill to drill 0.3mm, minimum pad ring 10mil, minimum via ring 6mil, stop-mask expansion 4mil, vias tented up to drill 25mil, thermal gap 10mil
Holes 2.8 mm at 3.5,3.5 51.5,3.5 3.5,51.5 51.5,51.5

### Footprints (pad centres in the part's own frame; a part is rotated, then mirrored left to right if it is on the bottom)
0402 = smd 0.59 x 0.64: 1 -0.51,0; 2 0.51,0
0603 = smd 0.9 x 0.95: 1 -0.8,0; 2 0.8,0
1210 = smd 1.15 x 2.65: 1 -1.48,0; 2 1.48,0
1206 = smd 1.15 x 1.8: 1 -1.48,0; 2 1.48,0
CAP_V = smd 3.764 x 2.115: 1 -3.426,0; 2 3.426,0
0805 = smd 1 x 1.45: 1 -0.95,0; 2 0.95,0
CAP_D = smd 2.1 x 2.5: 1 -2.9,0; 2 2.9,0
SOD323 = smd 0.8 x 0.9: A 1.35,0; C -1.35,0
SMA = smd 1.5 x 1.65: A 2.3,0; C -2.3,0
SOD123 = smd 0.95 x 1.2: A 1.85,0; C -1.85,0
SOT95P280X145-6N = smd 1.21 x 0.59: 1 -1.255,0.95; 2 -1.255,0; 3 -1.255,-0.95; 4 1.255,-0.95; 5 1.255,0; 6 1.255,0.95
FUSENANO2 = smd 2.6 x 2.4: 1 -2.6,0; 2 2.6,0
XH2 = drill 0.95 pad 1.7 square: 1 -1.25,0 | drill 0.95 pad 1.7: 2 1.25,0
HDR10 = drill 0.9 pad 1.6 square: 1 -11.43,0 | drill 0.9 pad 1.6: 2 -8.89,0; 3 -6.35,0; 4 -3.81,0; 5 -1.27,0; 6 1.27,0; 7 3.81,0; 8 6.35,0; 9 8.89,0; 10 11.43,0
XH3 = drill 0.95 pad 1.7 square: 1 -2.5,0 | drill 0.95 pad 1.7: 2 0,0; 3 2.5,0
SCREW3 = drill 1.3 pad 2.2 square: 1 -5,0 | drill 1.3 pad 2.2: 2 0,0; 3 5,0
HDR6 = drill 0.9 pad 1.6 square: 1 -6.35,0 | drill 0.9 pad 1.6: 2 -3.81,0; 3 -1.27,0; 4 1.27,0; 5 3.81,0; 6 6.35,0
SCREW2 = drill 1.3 pad 2.2 square: 1 -2.5,0 | drill 1.3 pad 2.2: 2 2.5,0
SCREW5 = drill 1.3 pad 2.2 square: 1 -7,0 | drill 1.3 pad 2.2: 2 -3.5,0; 3 0,0; 4 3.5,0; 5 7,0
HRO_TYPE-C-31-M-12 = smd 0.6 x 1.14: A1_B12 -3.2,4.75; A4_B9 -2.4,4.75; B1_A12 3.2,4.75; B4_A9 2.4,4.75 | smd 0.3 x 1.14: A5 -1.25,4.75; A6 -0.25,4.75; A7 0.25,4.75; A8 1.25,4.75; B5 1.75,4.75; B6 0.75,4.75; B7 -0.75,4.75; B8 -1.75,4.75 | drill 0.6 pad 1 long: S1 -4.325,4.17; S2 4.325,4.17; S3 -4.325,0; S4 4.325,0 | drill 0.6 pad 0.9: S1B -4.325,3.62; S1C -4.325,3.757; S1D -4.325,3.895; S1E -4.325,4.032; S1F -4.325,4.308; S1G -4.325,4.445; S1H -4.325,4.582; S1I -4.325,4.72; S2B 4.325,3.62; S2C 4.325,3.757; S2D 4.325,3.895; S2E 4.325,4.032; S2F 4.325,4.308; S2G 4.325,4.445; S2H 4.325,4.582; S2I 4.325,4.72; S3B -4.325,-0.55; S3C -4.325,-0.412; S3D -4.325,-0.275; S3E -4.325,-0.138; S3F -4.325,0.138; S3G -4.325,0.275; S3H -4.325,0.412; S3I -4.325,0.55; S4B 4.325,-0.55; S4C 4.325,-0.412; S4D 4.325,-0.275; S4E 4.325,-0.138; S4F 4.325,0.138; S4G 4.325,0.275; S4H 4.325,0.412; S4I 4.325,0.55 | hole 0.6: -2.89,3.68; 2.89,3.68
IND43 = smd 1.6 x 3.4: 1 -1.5,0; 2 1.5,0
LED0603 = smd 0.9 x 0.95: A 0.8,0; C -0.8,0
SOT23 = smd 0.9 x 1: 1 -0.95,-1; 2 0.95,-1; 3 0,1
SOT95P280X125-3N = smd 1.21 x 0.59: 1 -1.255,0.95; 2 -1.255,-0.95; 3 1.255,0
TACT = smd 1 x 0.75: 1 -3,1.875; 2 3,1.875; 3 -3,-1.875; 4 3,-1.875
SMB = smd 2 x 2.2: A 2.2,0; C -2.2,0
SOT236 = smd 0.6 x 1: 1 -0.95,-1.1; 2 0,-1.1; 3 0.95,-1.1; 4 0.95,1.1; 5 0,1.1; 6 -0.95,1.1
SOP65P640X120-29N = smd 1.5 x 0.45: 1 -2.9,4.225; 2 -2.9,3.575; 3 -2.9,2.925; 4 -2.9,2.275; 5 -2.9,1.625; 6 -2.9,0.975; 7 -2.9,0.325; 8 -2.9,-0.325; 9 -2.9,-0.975; 10 -2.9,-1.625; 11 -2.9,-2.275; 12 -2.9,-2.925; 13 -2.9,-3.575; 14 -2.9,-4.225; 15 2.9,-4.225; 16 2.9,-3.575; 17 2.9,-2.925; 18 2.9,-2.275; 19 2.9,-1.625; 20 2.9,-0.975; 21 2.9,-0.325; 22 2.9,0.325; 23 2.9,0.975; 24 2.9,1.625; 25 2.9,2.275; 26 2.9,2.925; 27 2.9,3.575; 28 2.9,4.225 | smd 0.1 x 0.1: 29 0,0 | drill 0.2 pad 0.3: 30 -1.2,4.2; 31 0,4.2; 32 1.2,4.2; 33 -1.2,3; 34 0,3; 35 1.2,3; 36 -1.2,1.8; 37 0,1.8; 38 1.2,1.8; 39 -1.2,0.6; 40 0,0.6; 41 1.2,0.6; 42 -1.2,-0.6; 43 0,-0.6; 44 1.2,-0.6; 45 -1.2,-1.8; 46 0,-1.8; 47 1.2,-1.8; 48 -1.2,-3; 49 0,-3; 50 1.2,-3; 51 -1.2,-4.2; 52 0,-4.2; 53 1.2,-4.2
XCVR_ESP32S3WROOM1N8R8 = smd 1.5 x 0.9: 1 -8.75,5.26; 2 -8.75,3.99; 3 -8.75,2.72; 4 -8.75,1.45; 5 -8.75,0.18; 6 -8.75,-1.09; 7 -8.75,-2.36; 8 -8.75,-3.63; 9 -8.75,-4.9; 10 -8.75,-6.17; 11 -8.75,-7.44; 12 -8.75,-8.71; 13 -8.75,-9.98; 14 -8.75,-11.25; 27 8.75,-11.25; 28 8.75,-9.98; 29 8.75,-8.71; 30 8.75,-7.44; 31 8.75,-6.17; 32 8.75,-4.9; 33 8.75,-3.63; 34 8.75,-2.36; 35 8.75,-1.09; 36 8.75,0.18; 37 8.75,1.45; 38 8.75,2.72; 39 8.75,3.99; 40 8.75,5.26 | smd 0.9 x 1.5: 15 -6.985,-12.5; 16 -5.715,-12.5; 17 -4.445,-12.5; 18 -3.175,-12.5; 19 -1.905,-12.5; 20 -0.635,-12.5; 21 0.635,-12.5; 22 1.905,-12.5; 23 3.175,-12.5; 24 4.445,-12.5; 25 5.715,-12.5; 26 6.985,-12.5 | smd 0.9 x 0.9: 41_1 -1.5,-2.46; 41_2 -2.9,-2.46; 41_3 -0.1,-2.46; 41_4 -2.9,-3.86; 41_5 -1.5,-3.86; 41_6 -0.1,-3.86; 41_7 -2.9,-1.06; 41_8 -1.5,-1.06; 41_9 -0.1,-1.06 | drill 0.2 pad 0.4: 41_10 -1.5,-1.76; 41_11 -2.9,-1.76; 41_12 -0.1,-1.76; 41_13 -2.9,-3.16; 41_14 -1.5,-3.16; 41_15 -0.1,-3.16; 41_16 -2.2,-1.06; 41_17 -0.8,-1.06; 41_18 -2.2,-2.46; 41_19 -0.8,-2.46; 41_20 -2.2,-3.86; 41_21 -0.8,-3.86

### Placement (x,y rotation side)
C_BOOT  51.7,43.6 270 top
C_BOOT_B  3.65,30.4 90 top
C_CP  23.5,7.3 90 top
C_EN  45.85,31.25 270 top
C_FF  16.32,31.7 270 top
C_IN1  5.97,32.95 0 top
C_IN2  10.9,25.85 0 top
C_IN_BULK  12.7,20.4 180 top
C_MCU1  41.45,27.5 90 top
C_MCU2  12.85,51.58 0 top
C_MCU3  25.16,21.34 0 top
C_MCU4  27.82,21.34 0 top
C_MCU_BULK  12.7,35.4 0 top
C_OUT1  8.2,48.6 0 top
C_OUT2  5.4,36.3 0 top
C_SENS  7.63,11.55 90 top
C_V3P3  25.7,7.25 270 top
C_VBUS  41.02,19.4 0 top
C_VCP  17.9,15.75 90 top
C_VM1  30.9,19.3 90 top
C_VM2  28.62,3.12 270 top
C_VM_BULK  34.3,13.21 270 top
D_CLC  1.9,29.7 90 top
D_CLW  1.9,34.45 90 top
D_MCU  31.62,21.57 0 top
D_OR_USB  40.5,11.35 90 top
D_Q1  15.7,8.9 0 top
D_USB  46.13,23.86 180 top
F1  22.2,3.2 0 top
J_BTN  52.65,37 90 top
J_EXP  38.77,35.38 90 top
J_KNOB  52.65,27.9 90 top
J_LED  2.75,42.9 270 top
J_MOTOR  38.6,3.7 0 top
J_PROG  41.42,40.45 90 top
J_PWR  12.1,3.6 0 top
J_SENSOR  3.5,16.7 270 top
J_USB  52.9,14.4 90 top
L1  11.05,30.98 0 top
LED_STATUS  20.9,21.7 0 top
Q1  9.95,9.6 180 top
Q_CW  10.34,44.65 180 top
Q_WW  10.41,40 180 top
R_AZ_A  16.1,39.4 270 top
R_AZ_B  16.1,42.4 270 top
R_AZ_C  16.1,45.4 270 top
R_BOOT  51.7,46.5 270 top
R_CC1  41.1,15.8 180 top
R_CC2  41.1,17.6 180 top
R_DM  41.02,21.18 180 top
R_DP  47.55,30.07 90 top
R_EN  43.85,31.25 270 top
R_EN_DRV  17.82,11.3 90 top
R_ENB  16.18,28 90 top
R_FBB  13.2,27.8 0 top
R_FBT  9.7,27.8 0 top
R_GC  14.62,42.7 270 top
R_GW  13.95,39.15 270 top
R_NFAULT  35.55,21.6 180 top
R_NRESET  21.2,7.3 90 top
R_NSLEEP  38.2,20.2 180 top
R_PDC  12.9,48.88 90 top
R_PDW  7,39.03 90 top
R_Q1  15.4,11.85 90 top
R_STATUS  20.9,19.8 180 top
SW_BOOT  45.7,45.05 90 top
SW_RST  45.73,37.05 270 top
TVS1  11.15,13.9 0 top
U_BUCK  6.15,28.25 0 top
U_DRV  24.25,14.18 90 top
U_MCU  27.27,38 0 top

### Tracks (layer width: path | path; a pad name or v marks a point on that pad's centre or on a via)
BOOT
  Top 0.152: R_BOOT.2 51.75,45.66 51.75,44.14 C_BOOT.1 51.67,44.14 43.83,44.14 | 43.83,44.14 43.83,42.08 SW_BOOT.1 43.76,42.01 41.7,42.01 41.47,41.78 J_PROG.4 41.4,41.7 40.33,40.64 40.33,36.48 39.17,35.31 38.01,35.31 37.65,34.95 37.65,32.7 37.44,32.49 37.44,27.85 36.38,26.79 36.07,26.79 U_MCU.27 | 43.83,44.14 43.83,48.02 SW_BOOT.2
BST
  Top 0.152: C_BOOT_B.1 3.65,29.83 4.72,29.83 5.17,29.38 U_BUCK.6
BTN  (via drill 0.25)
  Top 0.152: v25.14,24.08 24.12,25.09 24.12,25.49 U_MCU.18
  Bottom 0.152: v25.14,24.08 36.94,24.08 37.97,25.11 50.91,25.11 51.75,24.28 53.57,24.28 53.8,24.5 53.8,34.55 52.66,35.69 J_BTN.1
BUCK_EN
  Top 0.152: R_ENB.2 16.13,28.77 13.7,28.77 13.09,28.16 13.09,27.17 13.01,27.09 8.29,27.09 6.77,28.61 6.7,28.61 6.16,29.15 6.16,29.3 U_BUCK.5
CC1
  Top 0.152: R_CC1.1 41.93,15.75 44.67,15.75 47.26,13.16 48.09,13.16 J_USB.A5
CC2
  Top 0.152: R_CC2.1 41.93,17.58 44.93,17.58 46.3,16.21 48.09,16.21 J_USB.B5
CPH  (via drill 0.25)
  Top 0.152: v20.47,9.85 20.47,10.43 20.62,10.58 20.62,11.26 U_DRV.2 | C_CP.1 23.44,6.57 22.91,6.57 22.37,7.11 v22.37,7.31
  Bottom 0.152: v20.47,9.85 20.47,9.59 22.3,7.76 22.3,7.38 v22.37,7.31
CPL  (via drill 0.25)
  Top 0.152: v19.41,9.85 19.41,10.66 20.01,11.26 U_DRV.1 | v19.44,7.59 20.46,7.59 20.73,7.32 21.67,7.32 22.45,8.1 C_CP.2
  Bottom 0.152: v19.41,9.85 19.44,9.81 v19.44,7.59
CW_G
  Top 0.152: 12.94,43.53 11.8,43.53 11.64,43.68 Q_CW.1 | 12.94,43.53 14.61,43.53 R_GC.1 | 12.94,43.53 12.94,48.02 R_PDC.1
DRV_V3P3  (via drill 0.25)
  Top 0.152: v28.71,6.65 27.06,8.29 25.82,8.29 C_V3P3.1 | v29.15,16.36 28.46,17.05 U_DRV.15
  Bottom 0.152: v28.71,6.65 28.71,12.35 29.15,12.79 v29.15,16.36
DRVEN  (via drill 0.25)
  Top 0.152: 22.68,18.56 22.68,17.12 U_DRV.24 | U_DRV.22 23.89,17.12 23.89,18.75 23.57,19.07 23.15,19.07 22.68,18.59 22.68,18.56 | v20.93,18.56 20.93,18.11 21.31,17.73 21.31,17.12 U_DRV.26 | v17.43,13.7 17.32,13.7 17.82,13.2 R_EN_DRV.2 | v20.32,32.33 20.32,32.88 18.87,34.32 18.57,34.32 U_MCU.8 | v22.6,18.56 22.68,18.56
  Route2 0.152: v20.32,32.33 20.32,19.17 v20.93,18.56
  Bottom 0.152: v17.43,13.7 17.43,15.06 v20.93,18.56 v22.6,18.56
EN_RST  (via drill 0.25)
  Top 0.152: R_EN.2 43.91,30.52 44.29,30.52 45.81,32.04 C_EN.1 45.89,32.11 47.56,33.79 47.56,34.02 SW_RST.2 47.64,34.09 47.64,40.03 SW_RST.1 47.56,40.1 45.05,40.1 44.37,40.79 43.07,40.79 41.47,39.19 J_PROG.3 | v19.71,40.71 18.57,40.71 U_MCU.3
  Bottom 0.152: v19.71,40.71 25.17,40.71 37.95,27.93 39.59,27.93 40.33,28.67 40.33,38.05 41.4,39.12 J_PROG.3
ENCA
  Top 0.152: R_AZ_A.2 16.13,38.58 16.13,37.97 17.5,36.6 17.5,32.57 18.19,31.89 18.49,31.89 U_MCU.10 18.19,31.81 16.89,30.52 16.89,26.64 11.95,21.69 7.3,21.69 3.5,17.89 3.5,16.74 J_SENSOR.3
ENCB  (via drill 0.25)
  Top 0.152: v15.14,40.64 16.06,41.55 R_AZ_B.2 | U_MCU.11 18.57,30.52 18.87,30.52 19.56,29.83 20.01,29.83 21.38,31.2 v22.29,31.2
  Bottom 0.152: 15.14,37.97 v15.14,40.64 | J_SENSOR.4 3.46,13.2 1.83,14.84 1.83,26.03 13.77,37.97 15.14,37.97 | v22.29,31.2 20.55,31.2 15.14,36.6 15.14,37.97
ENCZ  (via drill 0.25)
  Top 0.152: v17.05,44.44 16.89,44.59 16.13,44.59 R_AZ_C.2 | v28.46,27.78 28.46,26.48 29.15,25.8 29.15,25.57 U_MCU.22
  Bottom 0.152: v17.05,44.44 17.05,43.83 17.24,43.64 | 17.24,43.64 19.18,41.7 19.18,35.43 22.6,32.01 22.62,32.01 26.85,27.78 v28.46,27.78 | J_SENSOR.5 3.46,9.7 1.52,11.64 1.52,27.93 17.24,43.64
EXP_IO1  (via drill 0.25)
  Top 0.152: v37.21,41.63 36.91,41.93 36.07,41.93 U_MCU.39
  Bottom 0.152: v37.21,41.63 37.21,41.38 38.13,40.46 39.39,40.46 39.98,39.87 39.98,30.24 38.81,29.07 J_EXP.3
EXP_IO2  (via drill 0.25)
  Top 0.152: v37.44,39.57 36.3,40.71 36.07,40.71 U_MCU.38
  Bottom 0.152: v37.44,39.57 37.44,32.88 38.73,31.58 J_EXP.4
EXP_IO13
  Top 0.152: U_MCU.21 27.93,25.57 27.93,28 28.23,28.31 33.03,28.31 35.01,26.33 35.01,26.18 35.16,26.03 36.83,26.03 37.75,26.94 37.75,32.34 38.73,33.33 38.73,34.09 J_EXP.5
EXP_IO38
  Top 0.152: U_MCU.31 36.07,31.89 36.38,31.89 37.34,32.85 37.34,35.21 38.73,36.6 J_EXP.6
EXP_IO39  (via drill 0.25)
  Top 0.152: v34.78,34.09 35.77,33.1 35.99,33.1 U_MCU.32
  Bottom 0.152: v34.78,34.09 34.78,37.14 36.91,39.27 36.91,39.8 37.21,40.1 37.82,40.1 38.73,39.19 J_EXP.7
EXP_IO40
  Top 0.152: U_MCU.33 35.99,34.4 35.69,34.4 33.94,36.15 33.94,42.77 35.16,43.99 36.83,43.99 38.73,42.08 38.73,41.78 J_EXP.8
EXP_IO41
  Top 0.152: U_MCU.34 36.07,35.69 36.38,35.69 37.35,36.66 37.35,37.24 38.03,37.93 39.49,37.93 40.03,38.46 40.03,41.02 40.18,41.17 40.18,42.84 38.81,44.21 J_EXP.9
EXP_IO42  (via drill 0.25)
  Top 0.152: v34.78,37.9 35.69,36.98 35.99,36.98 U_MCU.35
  Bottom 0.152: v34.78,37.9 34.78,39.65 34.24,40.18 34.24,42.31 38.73,46.8 J_EXP.10
FB  (via drill 0.25)
  Top 0.152: v15.52,31.12 16.29,31.12 C_FF.2 | R_FBB.1 12.33,27.78 v11.57,28.54 11.49,28.54 10.81,27.85 10.5,27.85 R_FBT.2 | v7.91,28.54 7.15,29.3 U_BUCK.4
  Bottom 0.152: v15.52,31.12 14.15,31.12 v11.57,28.54 v7.91,28.54
GND  (via drill 0.25)
  Top 0.152: U_MCU.41_7 U_MCU.41_1 25.85,35.54 25.89,35.5 | 3.88,37.29 5.02,37.29 5.94,36.38 6.32,36.38 C_OUT2.2 | 3.88,37.29 3.65,37.06 3.65,35.54 4.64,34.55 5.86,34.55 7.38,33.03 C_IN1.2 | 10.73,45.58 11.57,45.58 Q_CW.2 | 10.73,45.58 9.13,45.58 | 9.13,45.58 8.83,45.58 8.22,44.98 8.22,42.04 9.74,40.52 9.77,40.52 9.99,40.3 9.99,39.7 9.77,39.48 7.36,39.48 R_PDW.2 6.92,39.88 5.25,41.55 2.38,41.55 1.67,40.85 1.67,39.92 3.88,37.71 3.88,37.29 | 10.73,45.58 10.73,43.38 11.64,42.46 11.64,41.02 Q_WW.2 | 9.13,45.58 9.13,47.34 | 9.13,47.34 9.13,48.55 C_OUT1.2 | 9.13,47.34 6.52,47.34 6.17,47.69 6.17,49.79 9.06,52.68 12.83,52.68 13.64,51.87 C_MCU2.2 13.62,51.52 12.94,50.84 12.94,49.69 R_PDC.2 13.01,49.69 13.93,49.69 18.19,45.43 18.19,44.67 18.57,44.29 19.48,44.29 24.89,38.89 24.89,37.59 | U_MCU.41_7 24.35,36.91 24.2,36.91 23.74,36.45 23.74,35.99 24.12,35.62 24.35,35.62 U_MCU.41_2 24.12,35.54 23.74,35.16 23.74,34.63 24.35,34.02 U_MCU.41_4 24.43,34.09 24.43,33.94 24.89,33.48 25.27,33.48 25.72,33.94 25.72,34.09 U_MCU.41_5 25.8,33.94 26.25,33.48 26.71,33.48 27.17,33.94 27.17,34.09 U_MCU.41_6 27.24,34.02 27.78,34.55 27.78,35.16 27.4,35.54 U_MCU.41_3 27.24,35.62 27.4,35.62 27.78,35.99 27.78,36.53 27.4,36.91 27.24,36.91 U_MCU.41_9 27.55,36.83 35.01,44.29 37.75,44.29 | 24.89,37.59 25.27,37.59 25.72,37.14 25.72,36.98 U_MCU.41_8 | 24.89,37.59 24.28,36.98 U_MCU.41_7 | C_BOOT.2 51.67,43.07 48.63,43.07 47.64,42.08 SW_BOOT.3 | C_BOOT.2 51.75,43.15 52.43,43.83 52.43,46.27 52.28,46.42 51.29,46.42 49.69,48.02 47.64,48.02 SW_BOOT.4 47.56,48.09 46.88,48.78 41.93,48.78 40.33,47.18 40.33,46.88 39.19,45.74 38.73,45.74 37.75,44.75 37.75,44.29
  Top 0.152: 37.75,44.29 37.75,43.83 38.35,43.23 38.73,43.23 39.88,42.08 39.88,41.32 39.19,40.64 38.35,40.64 37.75,41.25 37.75,41.85 36.38,43.23 36.07,43.23 U_MCU.40 | U_DRV.10 25.95,11.34 25.95,12.02 26.25,12.33 26.79,12.33 27.17,11.95 27.17,11.34 U_DRV.12 27.24,11.26 27.78,11.26 U_DRV.13 27.85,11.26 28.46,11.26 U_DRV.14 | C_V3P3.2 25.65,6.5 25.65,6.8 24.52,7.92 24.52,9.63 23.97,10.18 23.97,11.26 U_DRV.7 | U_DRV.6 23.29,11.26 23.89,11.26 U_DRV.7 | U_DRV.10 25.87,12.02 25.57,12.33 24.35,12.33 23.97,11.95 23.97,11.34 U_DRV.7 | C_VM_BULK.2 34.24,9.74 29.07,9.74 29.02,9.69 26.69,9.69 25.95,10.43 25.95,11.26 U_DRV.10 | TVS1.A 13.51,13.81 14.46,12.86 14.86,12.86 R_Q1.2 15.37,12.74 15.37,13.67 17.57,15.87 19.12,15.87 20.02,16.77 U_DRV.28 | 23.06,16.06 24.89,16.06 25.19,16.36 25.19,17.05 U_DRV.20 25.27,17.05 25.87,17.05 U_DRV.19 25.72,17.12 25.72,21.23 C_MCU3.2 25.72,21.31 26.33,21.31 26.86,20.77 27.78,20.77 28.31,21.31 C_MCU4.2 28.39,21.31 29.3,21.31 30.44,20.17 30.9,20.17 C_VM1.2 30.97,20.17 32.34,21.54 32.95,21.54 D_MCU.A 33.03,21.61 33.48,21.61 38.35,26.48 38.73,26.48 J_EXP.2 38.81,26.56 40.64,28.39 41.4,28.39 C_MCU1.2 41.47,28.46 43.15,28.46 45.13,30.44 45.81,30.44 C_EN.2 | 23.06,16.06 20.39,16.06 20.09,16.36 20.09,17.05 U_DRV.28 | C_IN_BULK.2 9.31,20.17 12.63,20.17 14.15,21.69 18.1,21.69 18.24,21.55 18.24,18.9 20.01,17.12 U_DRV.28 | 23.06,12.71 23.44,12.33 23.52,12.33 23.89,11.95 U_DRV.7 | 23.06,16.06 23.06,12.71 | C_IN2.2 12.4,25.87 13.93,27.4 13.93,27.78 R_FBB.2 14,27.4 v14.92,27.4 | R_CC2.2 40.33,17.58 40.33,15.83 R_CC1.2 40.49,15.85 v42.4,13.94
  Top 0.152: C_SENS.2 7.69,12.02 8.22,11.49 8.22,2.04 8.55,1.71 12.66,1.71 14.54,3.58 J_PWR.2 14.61,3.58 16.44,1.75 26.18,1.75 26.71,2.28 28.61,2.28 C_VM2.2 | v22.1,23.89 20.17,21.96 20.17,21.77 LED_STATUS.C | 47.64,19.33 41.85,19.33 C_VBUS.2 | 47.64,19.33 48.17,18.8 J_USB.S2G J_USB.S2I 48.17,17.66 J_USB.B1_A12 | v4.41,27.09 5.17,27.09 U_BUCK.1 | SW_RST.4 43.83,34.09 43.83,34.24 41.47,36.6 J_PROG.2 41.47,36.68 43.83,39.04 43.83,40.03 SW_RST.3 | J_USB.A1_B12 48.17,11.19 48.17,10.12 J_USB.S1 | D_USB.2 47.41,23.82 47.72,23.82 48.25,23.29 48.25,20.01 47.64,19.41 47.64,19.33 | v17.27,42.84 17.66,43.23 18.49,43.23 U_MCU.1 | v16.21,37.14 15.6,36.53 15.6,35.46 C_MCU_BULK.2 | C_BOOT.2 51.67,43 51.67,39.19 52.59,38.28 J_BTN.2 | 23.06,12.71 23.07,12.72 23.07,13.22 23.41,13.56 23.86,13.56 24.25,13.95 U_DRV.29
  Bottom 0.152: v22.1,23.89 22.1,24.76 22.3,24.96 | 24.58,27.24 22.3,24.96 | 24.58,27.24 38.05,27.24 38.73,26.56 J_EXP.2 | v4.41,27.09 2.36,25.04 2.28,25.04 2.13,24.89 2.13,21.54 3.42,20.24 J_SENSOR.2 | 17.27,37.14 v17.27,42.84 | v42.4,13.94 44.35,13.94 48.17,10.12 J_USB.S1 | 17.27,37.14 v16.21,37.14 | v14.92,27.4 19.79,27.4 22.22,24.96 22.3,24.96 | 17.27,37.14 17.27,36.52 22.09,31.7 22.5,31.7 24.58,29.62 24.58,27.24
  pour Route2 (isolate 0.3): 15.54,38.81 15.53,38.81 15.48,38.85 15.48,38.86 15.47,38.87 15.47,54.5 0.5,54.5 0.5,0.5 54.5,0.5 54.5,54.5 38.52,54.5 38.52,38.9 38.53,38.88 38.52,38.88 38.52,38.87 38.52,38.86 38.52,38.85 38.52,38.85 38.52,38.85 38.51,38.84 38.51,38.84 38.5,38.83 38.49,38.83 38.47,38.81 38.46,38.81 38.46,38.8 15.55,38.8
GW_G
  Top 0.152: R_PDW.1 7,38.28 10.88,38.28 11.64,39.04 Q_WW.1 11.72,39.12 12.48,39.88 13.93,39.88 R_GW.1
LEDC_D  (via drill 0.5)
  Top 0.152: v3,31.89 2.74,31.89 | 9.13,44.59 Q_CW.3 | J_LED.3 2.82,40.33
  Top 0.25: 2.74,31.89 D_CLC.A | 9.13,44.59 9.13,41.63 9.88,40.88 9.91,40.88 10.35,40.44 10.35,39.56 9.8,39.01 4.14,39.01 2.82,40.33
  Bottom 0.25: J_LED.3 3,40.15 v3,31.89
LEDCW
  Top 0.152: R_GC.2 14.69,41.93 14.69,42.31 15.37,43 15.37,43.76 15.52,43.91 17.58,43.91 17.66,43.99 19.33,43.99 23.44,39.88 23.44,29.3 26.64,26.1 26.64,25.57 U_MCU.20
LEDW_D
  Top 0.152: 1.83,35.84 D_CLW.A | 2.74,42.84 J_LED.2 2.82,42.84 | 9.13,40.03 Q_WW.3
  Top 0.25: 1.83,35.84 1.83,39.27 1.29,39.8 1.29,41.4 2.74,42.84 | 9.13,40.03 8.22,40.03 5.4,42.84 2.82,42.84
LEDWW  (via drill 0.25)
  Top 0.152: v14,37.44 14,38.28 R_GW.2 | v21.08,29.81 22.47,29.81 25.34,26.94 25.34,25.57 U_MCU.19
  Bottom 0.152: v21.08,29.81 20.29,30.59 20.29,30.97 14,37.26 v14,37.44
MOT_U  (via drill 0.5)
  Top 0.152: U_DRV.5 22.68,11.26 22.68,10.6
  Top 0.25: v23.89,9.37 23.87,9.34 22.68,10.53 22.68,10.6
  Bottom 0.152: 23.93,9.37 v23.89,9.37
  Bottom 0.25: 23.93,9.37 27.87,5.43 31.21,5.43 J_MOTOR.1
MOT_V
  Top 0.152: 24.58,10.58 24.58,11.26 U_DRV.8 | J_MOTOR.2 38.58,3.73
  Top 0.25: 24.58,10.58 26.23,8.93 30.96,8.93 36.16,3.73 38.58,3.73
MOT_W
  Top 0.152: 25.27,10.58 25.27,11.26 U_DRV.9 | J_MOTOR.3 43.53,3.73
  Top 0.25: 25.27,10.58 25.27,10.54 26.48,9.33 31.13,9.33 34.98,5.48 41.78,5.48 43.53,3.73
NFAULT  (via drill 0.25)
  Top 0.152: v31.89,19.86 32.49,19.86 34.17,21.54 34.7,21.54 R_NFAULT.2 | U_DRV.18 26.56,17.12 26.56,18.19 28.23,19.86 v29.07,19.86 | v19.79,30.76 19.79,32.11 18.87,33.03 18.57,33.03 U_MCU.9
  Bottom 0.152: v31.89,19.86 v29.07,19.86 21.69,19.86 14.38,27.17 14.38,27.62 17.52,30.76 v19.79,30.76
NRESET  (via drill 0.25)
  Top 0.152: v22.88,9.32 21.66,8.1 R_NRESET.2 | v28.08,18.56 28.08,17.96 27.85,17.73 27.85,17.12 U_DRV.16
  Bottom 0.152: v22.88,9.32 22.88,9.71 25.49,12.33 26.25,12.33 26.64,12.71 26.64,17.12 v28.08,18.56
NSLEEP  (via drill 0.25)
  Top 0.152: 35.62,20.17 33.26,20.17 32.27,19.18 31.5,19.18 31.43,19.25 29.98,19.25 29.8,19.07 27.87,19.07 27.24,18.44 27.24,17.12 U_DRV.17 | 35.62,20.17 37.37,20.17 R_NSLEEP.2 | v19.71,35.62 18.57,35.62 U_MCU.7 | v40.03,26.71 40.03,26.25 38.81,25.04 37.9,25.04 35.62,22.75 35.62,20.17
  Bottom 0.152: v19.71,35.62 22.75,35.62 30.82,27.55 39.19,27.55 v40.03,26.71
P3V3  (via drill 0.25)
  Top 0.25: C_MCU2.1 11.7,51.23 11.7,50.02 | 11.7,50.02 11.7,49.08 11.85,48.93 13.39,48.93 16.06,46.27 R_AZ_C.1 16.21,46.19 v16.97,45.43 | C_OUT1.1 7.25,48.94 8.32,50.02 11.7,50.02 | 14.93,32.19 13.43,32.19 12.81,31.58 L1.2 12.55,30.74 11.51,29.69 | 14.93,32.19 16.29,32.19 C_FF.1 | 11.51,29.69 10.5,28.69 10.04,28.69 9.21,27.85 8.9,27.85 R_FBT.1 | 17.73,41.55 18.11,41.93 18.49,41.93 U_MCU.2 18.64,42.01 18.87,42.01 19.56,42.69 v19.71,42.69 | 17.73,41.55 16.44,40.26 16.13,40.26 R_AZ_A.1 15.98,40.18 15.52,40.18 14.46,39.12 13.39,39.12 9.74,35.46 C_MCU_BULK.1 | 17.73,41.55 16.13,43.15 R_AZ_B.1 | C_OUT2.1 4.49,36.3 4.72,36.3 5.78,35.23 9.59,35.23 9.74,35.39 C_MCU_BULK.1 | 14.93,32.19 11.72,35.4 | 11.72,35.4 | 11.72,35.4 C_MCU_BULK.1 | R_BOOT.1 51.75,47.26 51.98,47.26 53.8,45.43 53.8,37.75 52.97,36.91 51.67,36.91 48.32,33.56 48.32,33.03 46.65,31.35 46.65,29.91 43.3,26.56 41.47,26.56 C_MCU1.1 41.4,26.48 38.89,23.97 J_EXP.1 38.73,23.89 37.75,22.91 37.75,21.61 37.67,21.54 | R_NRESET.1 21.16,6.57 18.62,6.57 18.34,6.86 18.34,10.27 18.16,10.45 R_EN_DRV.1 16.92,11.26 v16.51,11.26 | C_MCU3.1 24.66,21.38 25.27,21.99 26.64,21.99 27.24,21.38 C_MCU4.1 27.32,21.46 27.85,21.99 29.15,21.99 29.53,21.61 30.21,21.61 D_MCU.C 30.36,21.61 v32.19,23.44 | 37.67,21.54 36.38,21.54 R_NFAULT.1 | 37.67,21.54 38.96,20.24 R_NSLEEP.1 | v6.77,11.87 7.23,11.41 7.31,11.41 7.61,11.11 C_SENS.1 | R_EN.1 43.83,32.11 43.45,32.11 41.47,34.09 J_PROG.1 | v11.03,30.17 11.51,29.69
  Bottom 0.25: v19.71,42.69 v16.97,45.43 | v32.19,23.44 38.28,23.44 38.73,23.89 J_EXP.1 | v16.51,11.26 7.38,11.26 v6.77,11.87 6.77,20.39 3.5,23.67 J_SENSOR.1 3.5,23.82 3.5,24.96 7.69,29.15 10.01,29.15 v11.03,30.17
  pour Route15 (isolate 0.3): 15.54,38.81 15.53,38.81 15.48,38.85 15.48,38.86 15.47,38.87 15.47,54.5 0.5,54.5 0.5,0.5 54.5,0.5 54.5,54.5 38.52,54.5 38.52,38.9 38.53,38.88 38.52,38.88 38.52,38.87 38.52,38.86 38.52,38.85 38.52,38.85 38.52,38.85 38.51,38.84 38.51,38.84 38.5,38.83 38.49,38.83 38.47,38.81 38.46,38.81 38.46,38.8 15.55,38.8
P24  (via drill 0.25)
  Top 0.4: R_ENB.1 16.13,27.17 15.68,27.17 13.09,24.58 10.65,24.58 9.44,25.8 C_IN2.1 9.21,25.87 8.9,25.87 7.69,27.09 7.15,27.09 U_BUCK.3 7.08,26.94 7.08,26.71 6.62,26.25 4.03,26.25 3.69,26.6 | D_CLW.C 1.83,33.03 1.06,32.27 1.06,30.52 1.83,29.75 1.83,28.39 D_CLC.C 2.06,28.23 3.69,26.6 | D_CLW.C 2.06,33.03 4.49,33.03 C_IN1.1 | J_LED.1 1.84,45.4 0.82,44.37 0.82,34.27 1.83,33.26 D_CLW.C | C_VM1.1 30.97,18.49 32.42,18.49 34.24,16.67 C_VM_BULK.1 | U_DRV.11 26.56,11.26 26.56,10.43 26.86,10.12 28.84,10.12 34.32,15.6 34.32,16.44 C_VM_BULK.1 | C_VM_BULK.1 34.24,15.3 40.48,9.06 D_OR_USB.C 41.34,9.05 45.63,4.76 45.63,2.82 44.41,1.61 30.96,1.61 28.77,3.81 C_VM2.1 28.61,3.96 27.09,3.96 25.57,5.48 v22.98,5.48 17.19,5.48 13.85,8.83 D_Q1.C 13.7,8.98 13.47,9.21 10.81,9.21 9.44,10.58 9.21,10.58 Q1.2 8.98,10.65 8.98,13.89 TVS1.C | C_IN_BULK.1 17.03,19.19 17.88,18.34 17.88,16.59 C_VCP.2 17.73,16.44 11.57,16.44 9,13.87 TVS1.C | v21.92,9.35 21.92,11.26 U_DRV.4 | 3.69,26.6 1.98,24.89 1.98,16.13 3.42,14.69 8.29,14.69 8.43,14.55 TVS1.C
  Bottom 0.4: v21.92,9.35 21.92,8.75 23.48,7.19 23.48,5.98 v22.98,5.48
P24_F
  Top 0.4: Q1.3 9.97,8.6 12.56,8.6 16.36,4.79 23.21,4.79 24.73,3.27 F1.2
P24_RAW
  Top 0.4: F1.1 19.56,3.27 17.05,3.27 14.52,5.8 11.81,5.8 9.66,3.65 J_PWR.1
PWMA  (via drill 0.25)
  Top 0.152: U_MCU.4 18.57,39.42 18.87,39.42 22.91,35.39 v22.91,32.44 v22.91,32.43 | U_DRV.27 20.62,17.12 20.62,17.81 19.41,19.02 19.41,22.3 19.61,22.5 19.61,26.34 19.75,26.48 19.91,26.48 v21.59,28.17
  Route15 0.152: v21.59,28.17 22.91,29.48 22.91,32.42 v22.91,32.43
PWMB  (via drill 0.25)
  Top 0.152: v24.35,22.71 24.05,22.41 24.05,20.85 21.99,18.8 21.99,17.12 U_DRV.25 | v21.58,34.13 21.58,35.42 18.87,38.13 18.57,38.13 U_MCU.5
  Route2 0.152: v24.35,22.71 24.35,26.41 22.53,28.23 22.53,29.22 21.58,30.17 v21.58,34.13
PWMC  (via drill 0.25)
  Top 0.152: v23.36,18.56 23.29,18.49 23.29,17.12 U_DRV.23 | U_MCU.6 18.49,36.98 18.19,36.98 17.5,37.67 17.5,38.51 16.67,39.34 15.52,39.34 15.37,39.19 15.37,38.05 14.31,36.98 14.31,34.07 15.54,32.84 v15.56,32.84
  Bottom 0.152: v23.36,18.56 22.52,19.41 21.69,19.41 14.08,27.02 14.08,28.92 16.06,30.9 16.06,32.27 15.56,32.76 v15.56,32.84
Q1G
  Top 0.152: D_Q1.A 17.5,8.9 15.45,10.96 15.45,10.99 R_Q1.1 15.39,10.98 15.07,10.65 10.96,10.65 Q1.1
ROTA  (via drill 0.25)
  Top 0.152: v24.81,26.71 22.22,29.3 18.57,29.3 U_MCU.12
  Bottom 0.152: v24.81,26.71 37.06,26.71 38.35,25.42 52.59,25.42 J_KNOB.1
ROTB  (via drill 0.25)
  Top 0.152: U_MCU.17 22.83,24.76 v23.52,24.08 | v48.7,24.58 49.31,24.58 52.59,27.85 J_KNOB.2
  Bottom 0.152: v48.7,24.58 44.59,24.58 42.92,22.91 25.59,22.91 24.42,24.08 v23.52,24.08
STAT
  Top 0.152: R_STATUS.1 21.77,19.86 21.77,20.47 23.52,22.22 23.52,23.13 23.95,23.57 28.82,23.57 30.44,25.19 U_MCU.23
STAT_A
  Top 0.152: LED_STATUS.A 20.17,20.17 20.17,19.86 R_STATUS.2
SW
  Top 0.152: U_BUCK.2 6.09,27.17 6.09,27.4 4.87,28.61 3.96,28.61 3.04,29.53 3.04,30.36 3.58,30.9 C_BOOT_B.2 9.48,30.91 L1.1
U0RXD  (via drill 0.25)
  Top 0.152: v34.78,41.17 34.24,40.64 34.24,39.65 35.69,38.2 35.99,38.2 U_MCU.36
  Bottom 0.152: v34.78,41.17 34.78,41.78 38.73,45.74 40.41,45.74 41.4,46.73 J_PROG.6
U0TXD  (via drill 0.25)
  Top 0.152: v34.78,40.41 35.69,39.5 35.99,39.5 U_MCU.37
  Bottom 0.152: v34.78,40.41 35.23,40.41 38.05,43.23 40.41,43.23 41.4,44.21 J_PROG.5
USB_DM_MCU  (via drill 0.25)
  Top 0.152: v39.34,21.23 40.18,21.23 R_DM.2 | v17.27,26.25 17.27,27.09 18.19,28 18.49,28 U_MCU.13
  Bottom 0.152: v17.27,26.25 19.13,26.25 21.59,23.79 21.59,23.69 24.05,21.23 v39.34,21.23
USB_DP_MCU  (via drill 0.25)
  Top 0.152: v49.24,24.05 51.67,26.48 52.81,26.48 53.8,27.47 53.8,28.31 53.12,28.99 52.51,28.99 50.68,30.82 47.56,30.82 R_DP.2 | v19.02,25.65 19.02,26.25 18.57,26.71 U_MCU.14
  Bottom 0.152: v49.24,24.05 44.52,24.05 41.17,20.7 23.97,20.7 v19.02,25.65
USBDM_RAW
  Top 0.152: 47.33,14.38 47.33,13.85 47.49,13.7 48.09,13.7 J_USB.B7 | 47.33,14.38 47.56,14.61 48.09,14.61 J_USB.A7 | D_USB.1 47.33,22.91 44.9,22.91 D_USB.6 44.82,22.91 43.15,21.23 41.85,21.23 R_DM.1 41.78,21.16 41.09,20.47 41.09,17.12 41.32,16.89 43.99,16.89 46.5,14.38 47.33,14.38
USBDP_RAW
  Top 0.152: 48.74,15.11 48.7,15.14 48.17,15.14 J_USB.B6 | 48.74,15.11 49.01,14.84 49.01,14.46 48.7,14.15 48.17,14.15 J_USB.A6 | R_DP.1 47.49,29.22 47.49,24.96 47.41,24.89 D_USB.3 | D_USB.4 44.9,24.81 47.33,24.81 D_USB.3 | 48.74,15.11 50.07,16.44 50.07,22.45 47.56,24.96 D_USB.3
VBUS  (via drill 0.25)
  Top 0.25: C_VBUS.1 40.18,19.33 40.18,18.87 39.57,18.26 39.57,14.61 40.48,13.7 D_OR_USB.A 40.56,13.55 42.08,12.02 46.41,12.02 | 46.41,12.02 48.09,12.02 J_USB.A4_B9 | v46.41,16.82 48.09,16.82 J_USB.B4_A9 | 46.41,12.02 v46.41,12.63 | v46.06,23.44 45.68,23.82 44.9,23.82 D_USB.5
  Bottom 0.25: v46.41,12.63 v46.41,16.82 46.06,17.16 v46.06,23.44
VCP
  Top 0.152: C_VCP.1 17.96,14.92 17.96,13.55 18.9,12.6 18.9,9.64 19.2,9.34 20.68,9.34 21.31,9.97 21.31,11.26 U_DRV.3

### Text on the board
tNames: A | Bosza v4.2 / Designed by R. Raimundo